# Altium project Kintex_SDR.PrjPcb (part 1 of 3)
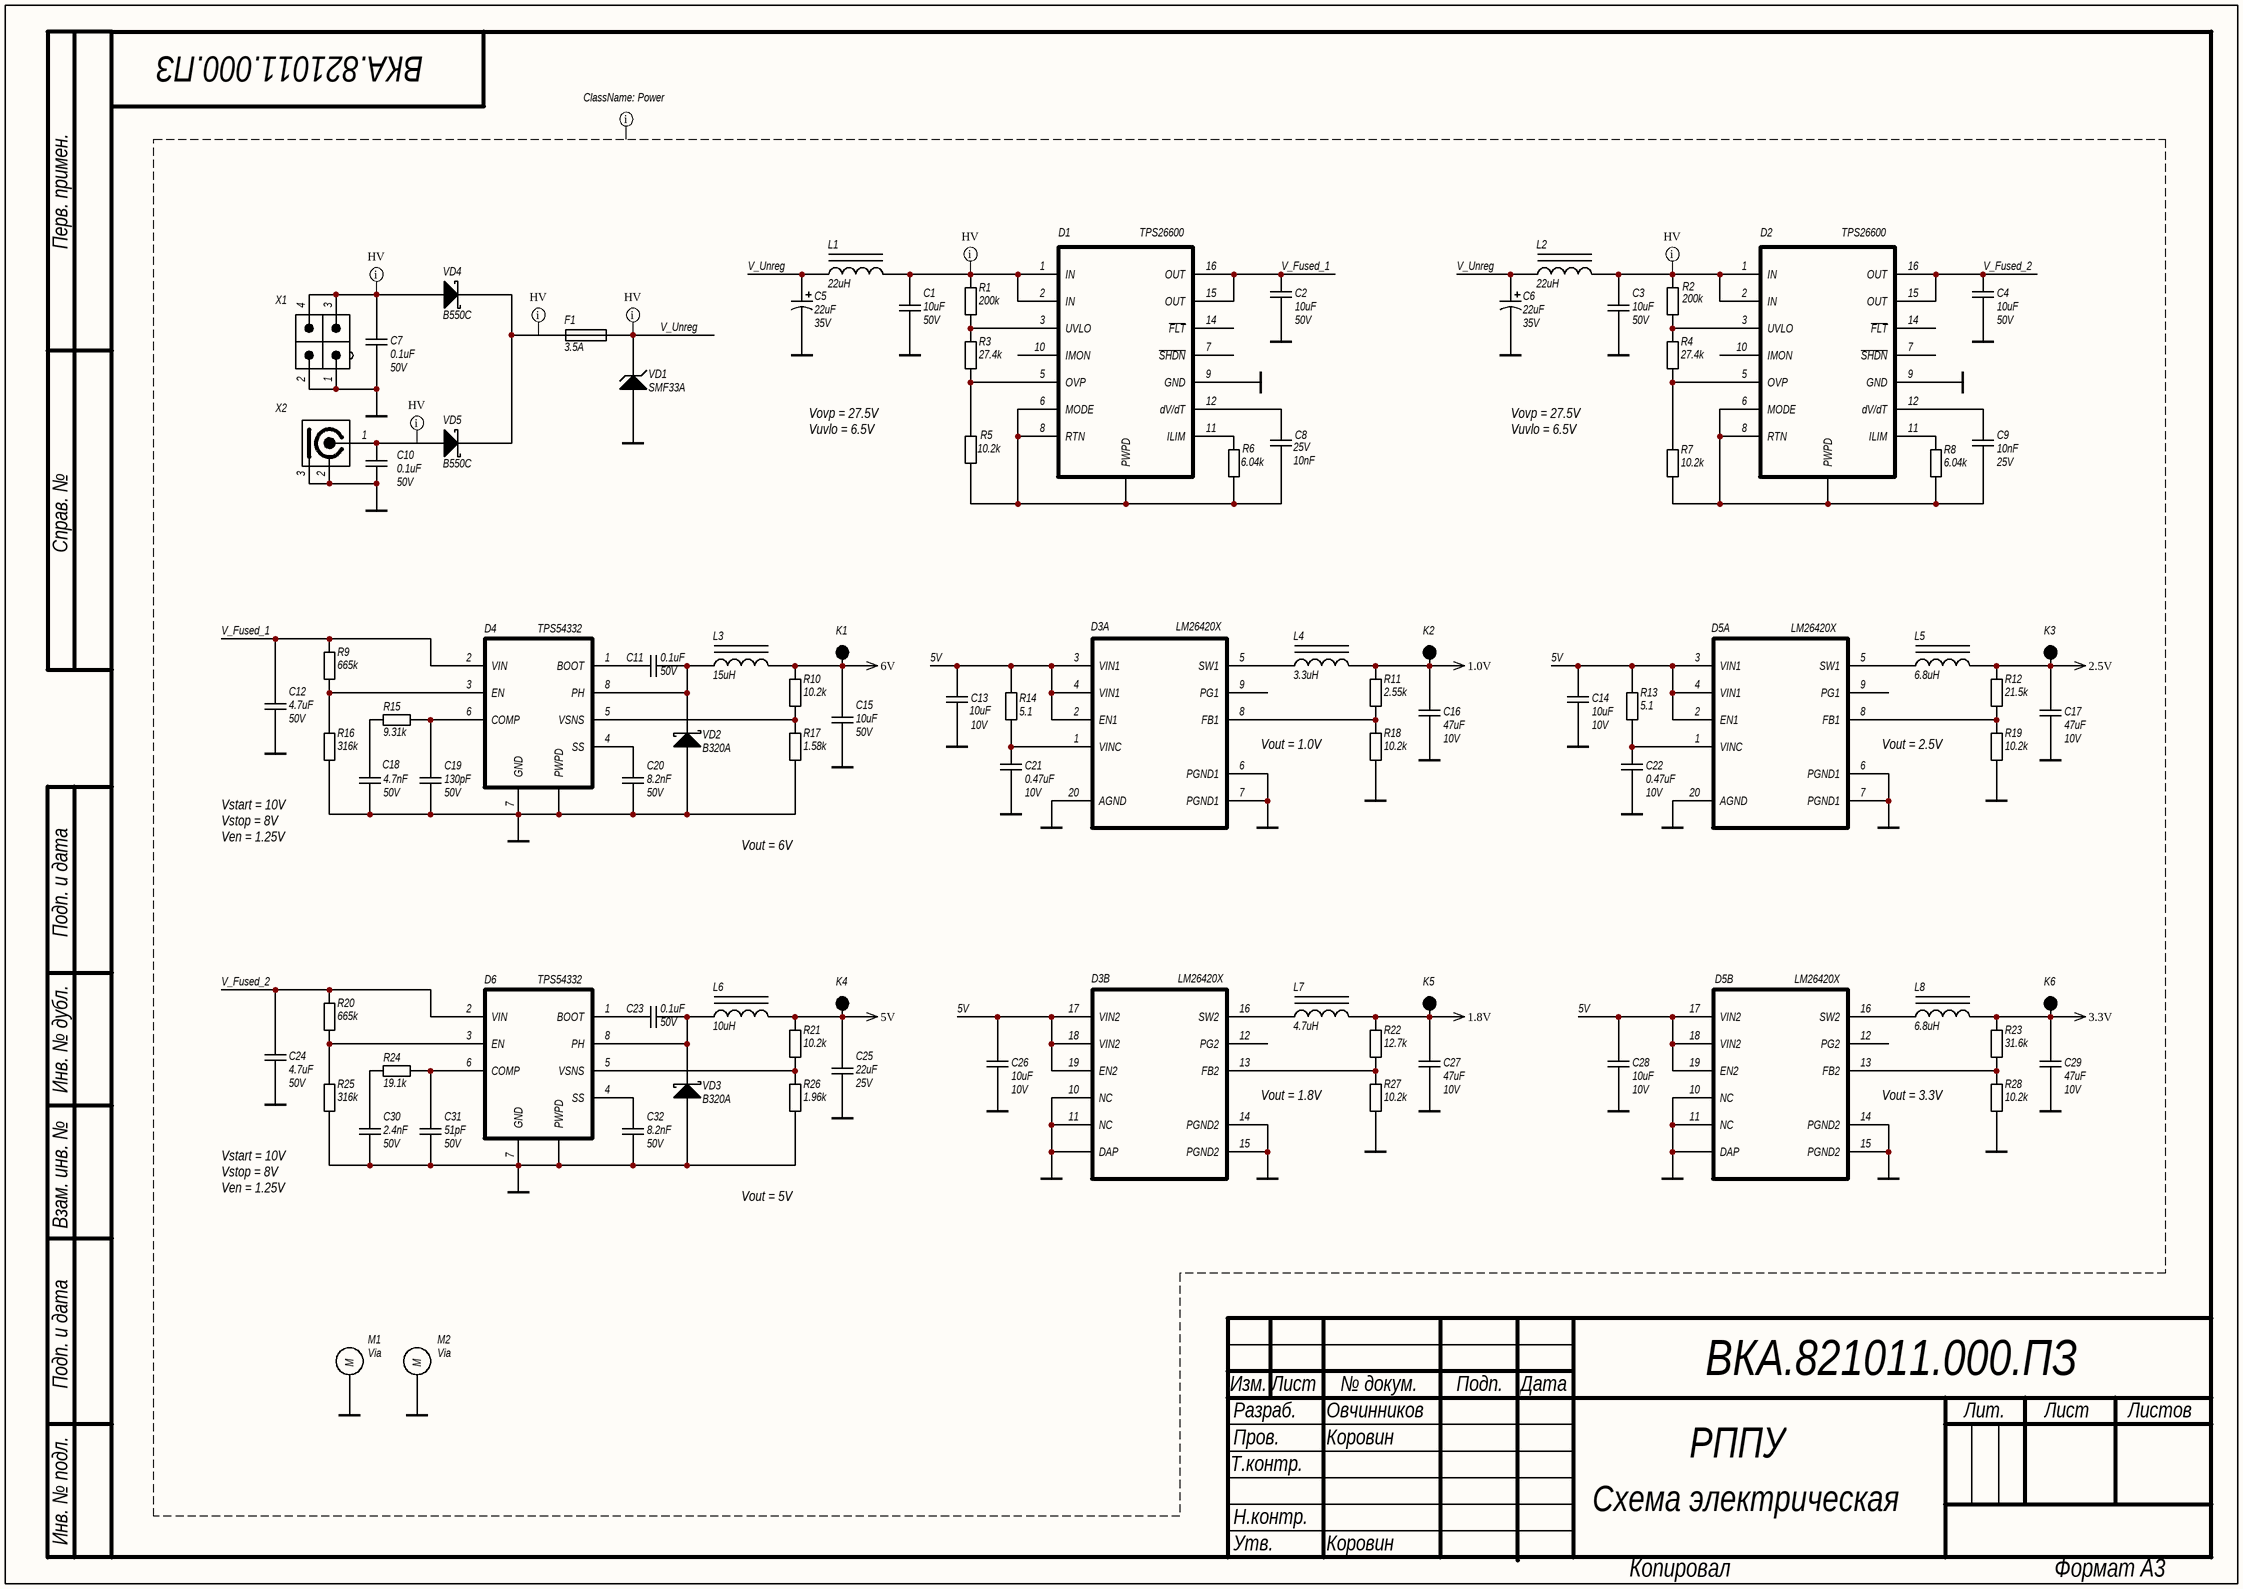
[diagram p0: PowerSupply.SchDoc]
6 sheets, 554 parts. Net scope: global (net labels, ports and power ports of the same name join across sheets).
Board file: MotherBoard.PcbDoc
Sheets:
  PowerSupply.SchDoc
  FPGAPower.SchDoc
  Configuration&Clocking&SRAM.SchDoc
  Codec's.SchDoc
  DaughterBoard.SchDoc
  Ethernet.SchDoc

## Sheet PowerSupply.SchDoc: РППУ
size 420 x 297 mm; ApprovedBy: Коровин; CheckedBy: Коровин; DrawnBy: Овчинников; DocumentNumber: ВКА.821011.000.ПЗ; Scale: {Мш.}; PageSetup: Record=PageOptions|CenterHorizontal=False|CenterVertical=False|PrintScale=0.70|XCorrection=0.00|YCorrection=0.00|PrintKind=1|BorderSize=5000000|LeftOffset=0|BottomOffset=0|Orientation=2|PaperLength=1000|PaperWidth=1000|Scale=100|PaperSource=15|PrintQuality=-3|MediaType=1|DitherType=10|PrintScaleMode=1|PaperKind=A4|PaperIndex=9; Mass: {М.}; DocumentType: Схема электрическая; Rule: PcbType=ProtelPcb

### Parts
C1  value 10uF  Voltage: 50V  [C1210]  (hidden comment: CAP uF)
C2  value 10uF  Voltage: 50V  [C1210]  (hidden comment: CAP uF)
C3  value 10uF  Voltage: 50V  [C1210]  (hidden comment: CAP uF)
C4  value 10uF  Voltage: 50V  [C1210]  (hidden comment: CAP uF)
C5  value 22uF  Voltage: 35V  [Tantalum_D]  (hidden comment: Cap Polarity)
C6  value 22uF  Voltage: 35V  [Tantalum_D]  (hidden comment: Cap Polarity)
C7  value 0.1uF  Voltage: 50V  [C0402]  (hidden comment: CAP)
C8  value 10nF  Voltage: 25V  [C0402]  (hidden comment: CAP)
C9  value 10nF  Voltage: 25V  [C0402]  (hidden comment: CAP)
C10  value 0.1uF  Voltage: 50V  [C0402]  (hidden comment: CAP)
C11  value 0.1uF  Voltage: 50V  [C0402]  (hidden comment: CAP)
C12  value 4.7uF  Voltage: 50V  [C0805]  (hidden comment: CAP uF)
C13  value 10uF  Voltage: 10V  [C0805]  (hidden comment: CAP uF)
C14  value 10uF  Voltage: 10V  [C0805]  (hidden comment: CAP uF)
C15  value 10uF  Voltage: 50V  [C1210]  (hidden comment: CAP uF)
C16  value 47uF  Voltage: 10V  [C1210]  (hidden comment: CAP uF)
C17  value 47uF  Voltage: 10V  [C1210]  (hidden comment: CAP uF)
C18  value 4.7nF  Voltage: 50V  [C0603]  (hidden comment: CAP)
C19  value 130pF  Voltage: 50V  [C0402]  (hidden comment: CAP)
C20  value 8.2nF  Voltage: 50V  [C0402]  (hidden comment: CAP)
C21  value 0.47uF  Voltage: 10V  [C0603]  (hidden comment: CAP)
C22  value 0.47uF  Voltage: 10V  [C0603]  (hidden comment: CAP)
C23  value 0.1uF  Voltage: 50V  [C0402]  (hidden comment: CAP)
C24  value 4.7uF  Voltage: 50V  [C0805]  (hidden comment: CAP uF)
C25  value 22uF  Voltage: 25V  [C1210]  (hidden comment: CAP uF)
C26  value 10uF  Voltage: 10V  [C0805]  (hidden comment: CAP uF)
C27  value 47uF  Voltage: 10V  [C1210]  (hidden comment: CAP uF)
C28  value 10uF  Voltage: 10V  [C0805]  (hidden comment: CAP uF)
C29  value 47uF  Voltage: 10V  [C1210]  (hidden comment: CAP uF)
C30  value 2.4nF  Voltage: 50V  [C0603]  (hidden comment: CAP)
C31  value 51pF  Voltage: 50V  [C0402]  (hidden comment: CAP)
C32  value 8.2nF  Voltage: 50V  [C0402]  (hidden comment: CAP)
D1  TPS26600  [R-PDSO-G16]
D2  TPS26600  [R-PDSO-G16]
D3  LM26420X  [HTSSOP-20]  (parts A,B of 2)
D4  TPS54332  [R-PDSO-G8]
D5  LM26420X  [HTSSOP-20]  (parts A,B of 2)
D6  TPS54332  [R-PDSO-G8]
F1  Current: 3.5A  [Fuse]  (hidden comment: FUSE)
K1  6V  [Control Point]  (value not drawn)
K2  1.0V  [Control Point]  (value not drawn)
K3  2.5V  [Control Point]  (value not drawn)
K4  5V  [Control Point]  (value not drawn)
K5  1.8V  [Control Point]  (value not drawn)
K6  3.3V  [Control Point]  (value not drawn)
L1  value 22uH  [XAL6060-223]  (hidden comment: Inductor PWR)
L2  value 22uH  [XAL6060-223]  (hidden comment: Inductor PWR)
L3  value 15uH  [XAL5050]  (hidden comment: Inductor PWR)
L4  value 3.3uH  [XAL4030]  (hidden comment: Inductor PWR)
L5  value 6.8uH  [XAL4030]  (hidden comment: Inductor PWR)
L6  value 10uH  [XAL5050]  (hidden comment: Inductor PWR)
L7  value 4.7uH  [XAL4030]  (hidden comment: Inductor PWR)
L8  value 6.8uH  [XAL4030]  (hidden comment: Inductor PWR)
M1  Via  [Mechanical_Via]
M2  Via  [Mechanical_Via]
R1  value 200k  [R0402]  (hidden comment: RES)
R2  value 200k  [R0402]  (hidden comment: RES)
R3  value 27.4k  [R0402]  (hidden comment: RES)
R4  value 27.4k  [R0402]  (hidden comment: RES)
R5  value 10.2k  [R0402]  (hidden comment: RES)
R6  value 6.04k  [R0402]  (hidden comment: RES)
R7  value 10.2k  [R0402]  (hidden comment: RES)
R8  value 6.04k  [R0402]  (hidden comment: RES)
R9  value 665k  [R0402]  (hidden comment: RES)
R10  value 10.2k  [R0402]  (hidden comment: RES)
R11  value 2.55k  [R0402]  (hidden comment: RES)
R12  value 21.5k  [R0402]  (hidden comment: RES)
R13  value 5.1  [R0402]  (hidden comment: RES)
R14  value 5.1  [R0402]  (hidden comment: RES)
R15  value 9.31k  [R0402]  (hidden comment: RES)
R16  value 316k  [R0402]  (hidden comment: RES)
R17  value 1.58k  [R0402]  (hidden comment: RES)
R18  value 10.2k  [R0402]  (hidden comment: RES)
R19  value 10.2k  [R0402]  (hidden comment: RES)
R20  value 665k  [R0402]  (hidden comment: RES)
R21  value 10.2k  [R0402]  (hidden comment: RES)
R22  value 12.7k  [R0402]  (hidden comment: RES)
R23  value 31.6k  [R0402]  (hidden comment: RES)
R24  value 19.1k  [R0402]  (hidden comment: RES)
R25  value 316k  [R0402]  (hidden comment: RES)
R26  value 1.96k  [R0402]  (hidden comment: RES)
R27  value 10.2k  [R0402]  (hidden comment: RES)
R28  value 10.2k  [R0402]  (hidden comment: RES)
VD1  SMF33A  [SOD-123F]
VD2  B320A  [Diode_SMA]
VD3  B320A  [Diode_SMA]
VD4  B550C  [Diode_SMC]
VD5  B550C  [Diode_SMC]
X1  miniFit  [2x2 PWR_HDR]  (value not drawn)
X2  POWER  [DC_CONNECTOR]  (value not drawn)

### Nets
1.0V: C16.2 K2.1 L4.2 R11.2
1.8V: C27.2 K5.1 L7.2 R22.2
2.5V: C17.2 K3.1 L5.2 R12.2
3.3V: C29.2 K6.1 L8.2 R23.2
5V: C13.2 C14.2 C25.2 C26.2 C28.2 D3.2(EN1) D3.3(VIN1) D3.4(VIN1) D3.17(VIN2) D3.18(VIN2) D3.19(EN2) D5.2(EN1) D5.3(VIN1) D5.4(VIN1) D5.17(VIN2) D5.18(VIN2) D5.19(EN2) K4.1 L6.2 R13.2 R14.1 R21.2
6V: C15.2 K1.1 L3.2 R10.2
GND: C1.1 C2.1 C3.1 C4.1 C5.2 C6.2 C7.1 C10.1 C12.1 C13.1 C14.1 C15.1 C16.1 C17.1 C18.2 C19.1 C20.1 C21.2 C22.1 C24.1 C25.1 C26.1 C27.1 C28.1 C29.1 C30.1 C31.1 C32.1 D1.9(GND) D2.9(GND) D3.6(PGND1) D3.7(PGND1) D3.10(NC) D3.11(NC) D3.14(PGND2) D3.15(PGND2) D3.20(AGND) D3.21(DAP) D4.7(GND) D4.9(PWPD) D5.6(PGND1) D5.7(PGND1) D5.10(NC) D5.11(NC) D5.14(PGND2) D5.15(PGND2) D5.20(AGND) D5.21(DAP) D6.7(GND) D6.9(PWPD) M1.0(M) M2.0(M) R16.1 R17.1 R18.1 R19.1 R25.1 R26.1 R27.1 R28.1 VD1.2(A) VD2.2(A) VD3.2(A) X1.1 X1.2 X2.2(GND) X2.3(GND)  [project net AGND_TX]
V_Fused_1: C2.2 C12.2 D1.15(OUT) D1.16(OUT) D4.2(VIN) R9.2
V_Fused_2: C4.2 C24.2 D2.15(OUT) D2.16(OUT) D6.2(VIN) R20.2
V_Unreg: C5.1 C6.1 F1.2 L1.1 L2.1 VD1.1(K)
NetC1_2: C1.2 D1.1(IN) D1.2(IN) L1.2 R1.2
NetC3_2: C3.2 D2.1(IN) D2.2(IN) L2.2 R2.1
NetC7_2: C7.2 VD4.2(A) X1.3 X1.4
NetC8_1: C8.1 D1.6(MODE) D1.8(RTN) D1.17(PWPD) R5.2 R6.1
NetC8_2: C8.2 D1.12(dV/dT)
NetC9_1: C9.1 D2.6(MODE) D2.8(RTN) D2.17(PWPD) R7.1 R8.1
NetC9_2: C9.2 D2.12(dV/dT)
NetC10_2: C10.2 VD5.2(A) X2.1(RF)
NetC11_1: C11.1 D4.8(PH) L3.1 VD2.1(K)
NetC11_2: C11.2 D4.1(BOOT)
NetC18_1: C18.1 R15.1
NetC19_2: C19.2 D4.6(COMP) R15.2
NetC20_2: C20.2 D4.4(SS)
NetC21_1: C21.1 D3.1(VINC) R14.2
NetC22_2: C22.2 D5.1(VINC) R13.1
NetC23_1: C23.1 D6.8(PH) L6.1 VD3.1(K)
NetC23_2: C23.2 D6.1(BOOT)
NetC30_2: C30.2 R24.2
NetC31_2: C31.2 D6.6(COMP) R24.1
NetC32_2: C32.2 D6.4(SS)
NetD1_3: D1.3(UVLO) R1.1 R3.2
NetD1_5: D1.5(OVP) R3.1 R5.1
NetD1_11: D1.11(ILIM) R6.2
NetD2_3: D2.3(UVLO) R2.2 R4.2
NetD2_5: D2.5(OVP) R4.1 R7.2
NetD2_11: D2.11(ILIM) R8.2
NetD3_5: D3.5(SW1) L4.1
NetD3_8: D3.8(FB1) R11.1 R18.2
NetD3_13: D3.13(FB2) R22.1 R27.2
NetD3_16: D3.16(SW2) L7.1
NetD4_3: D4.3(EN) R9.1 R16.2
NetD4_5: D4.5(VSNS) R10.1 R17.2
NetD5_5: D5.5(SW1) L5.1
NetD5_8: D5.8(FB1) R12.1 R19.2
NetD5_13: D5.13(FB2) R23.1 R28.2
NetD5_16: D5.16(SW2) L8.1
NetD6_3: D6.3(EN) R20.1 R25.2
NetD6_5: D6.5(VSNS) R21.1 R26.2
NetF1_1: F1.1 VD4.1(K) VD5.1(K)

Not connected (* = marked no-connect by the designer): D1 7(~{SHDN}) 10(IMON) 14(~{FLT}); D2 7(~{SHDN}) 10(IMON) 14(~{FLT}); D3 9(PG1) 12(PG2); D5 9(PG1) 12(PG2)

### Layout directives
net class Power: 1.0V, 1.8V, 2.5V, 3.3V, 5V, 6V, GND, V_Fused_1, V_Fused_2, V_Unreg
net class HV: NetC1_2, NetC3_2, NetC7_2, NetC10_2, NetF1_1, V_Unreg

### Notes on the sheet
- Vovp = 27.5V
  Vuvlo = 6.5V
- Vout = 1.0V
- Vout = 2.5V
- Vstart = 10V
  Vstop = 8V
  Ven = 1.25V
- Vout = 6V
- Vout = 1.8V
- Vout = 3.3V
- Vout = 5V
- Перв. примен.
- Справ. №
- Подп. и дата
- Инв. № дубл.
- Взам. инв. №
- Изм.
- Лист
- № докум.
- Подп.
- Дата
- Т.контр.
- Пров.
- Разраб.
- Лит.
- Листов
- Инв. № подл.
- Н.контр.
- Утв.
- Копировал
- Формат А3

### Library data of the parts
C1-C4 C15 = CAP uF: SMD Capacitor; Manufacturer: Murata; Material: X7R; Tolerance: 10%; Type: Ceramic Capacitor; P/N: GRM32ER71H106KA12L
C5 C6 = Cap Polarity: Tantalum Polarity SMD Capacitor; Manufacturer: AVX Corporation; Name: Tantalum Capacitor; Tolerance: 10%; Type: Tantalum Polarity Cap; P/N: TPSD226K035R0200; Temperature Range: -55…85°C
C7 C10 C11 C23 = CAP: SMD Capacitor; Manufacturer: Murata; Material: X7R; Tolerance: 10%; Type: Ceramic Capacitor; P/N: GRM155R71H104KE14J
C8 C9 = CAP: SMD Capacitor; Manufacturer: Murata; Material: X7R; Tolerance: 5%; Type: Ceramic Capacitor; P/N: GRM155R71E103KA01D
C12 C24 = CAP uF: SMD Capacitor; Manufacturer: Murata; Material: X5R; Tolerance: 20%; Type: Ceramic Capacitor; P/N: GRM21BR61H475KE51L
C13 C14 C26 C28 = CAP uF: SMD Capacitor; Manufacturer: Murata; Material: X5R; Tolerance: 10%; Type: Ceramic Capacitor; P/N: GRM21BR71A106KE51L
C16 C17 C27 C29 = CAP uF: SMD Capacitor; Manufacturer: Murata; Material: X7R; Tolerance: 10%; Type: Ceramic Capacitor; P/N: GRM32ER71A476KE15L
C18 = CAP: SMD Capacitor; Manufacturer: Murata; Material: NP0; Tolerance: 5%; Type: Ceramic Capacitor; P/N: GRM1885C1H472JA01D
C19 = CAP: SMD Capacitor; Manufacturer: Murata; Material: NP0; Tolerance: 5%; Type: Ceramic Capacitor; P/N: GRM1555C1H131JA01D
C20 C32 = CAP: SMD Capacitor; Manufacturer: Murata; Material: X7R; Tolerance: 10%; Type: Ceramic Capacitor; P/N: GRM155R71H822KA88D
C21 C22 = CAP: SMD Capacitor; Manufacturer: Murata; Material: X7R; Tolerance: 10%; Type: Ceramic Capacitor; P/N: GRM188R71A474KA61D
C25 = CAP uF: SMD Capacitor; Manufacturer: Murata; Material: X7R; Tolerance: 10%; Type: Ceramic Capacitor; P/N: GRM32ER71E226KE15L
C30 = CAP: SMD Capacitor; Manufacturer: Murata; Material: NP0; Tolerance: 5%; Type: Ceramic Capacitor; P/N: GRM1885C1H242JA01D
C31 = CAP: SMD Capacitor; Manufacturer: Murata; Material: NP0; Tolerance: 5%; Type: Ceramic Capacitor; P/N: GRM1555C1H510JA01D
D1 D2 = TPS26600: Industrial eFuse; Current: 2A; Voltage: 60V; Name: TPS26600; Package: 16-Pin SOIC PowerPAD; Temperature Range: −40°C to + 125°C; Type: Industrial eFuse
D3 D5 = LM26420X: Synchronous  DC-DC Converter; Current: 2A; Frequency: 2.2MHz; Input Voltage: 3 V to 5.5 V; Name: LM26420X; Package: HTSSOP 20; Temperature Range: −40°C to + 150°C; Type: Synchronous DC-DC Converter
D4 D6 = TPS54332: Step-Down DC-DC Converter; Current: 3.5A; Frequency: 1MHz; Input Voltage: 3.5V to 28V; Name: TPS54332; Package: 8-Pin SOIC PowerPAD; Temperature Range: −40°C to + 150°C; Type: Step-Down DC-DC Converter
F1 = FUSE: Chip SMD Fuse; Name: Fast Fuse; Type: Fast Chip SMD Fuse; Voltage: 125V; Package: SMD Omni Block
K1-K6 = Test  Point
L1 L2 = Inductor PWR: Magnetic-Core Inductor; Manufacturer: Coilcraft; Name: XAL6060-223MEB; Current: 5A; Tolerance: ±30%; Temperature Range: -40ºC to 125ºC
L3 = Inductor PWR: Magnetic-Core Inductor; Manufacturer: Coilcraft; Name: XAL5050-153MEB; Current: 5A; Tolerance: ±30%; Temperature Range: -40ºC to 125ºC
L4 = Inductor PWR: Magnetic-Core Inductor; Manufacturer: Coilcraft; Name: XEL4030-332MEB; Current: 5A; Tolerance: ±30%; Temperature Range: -40ºC to 125ºC
L5 L8 = Inductor PWR: Magnetic-Core Inductor; Manufacturer: Coilcraft; Name: XEL4030-682MEB; Current: 5A; Tolerance: ±30%; Temperature Range: -40ºC to 125ºC
L6 = Inductor PWR: Magnetic-Core Inductor; Manufacturer: Coilcraft; Name: XAL5050-103MEB; Current: 5A; Tolerance: ±30%; Temperature Range: -40ºC to 125ºC
L7 = Inductor PWR: Magnetic-Core Inductor; Manufacturer: Coilcraft; Name: XEL4030-472MEB; Current: 5A; Tolerance: ±30%; Temperature Range: -40ºC to 125ºC
M1 M2 = Mechanical Via
R1 R2 = RES: SMD Resistor; Manufacturer: Panasonic Electronic Components; Name: Chip SMD Resistor; Power: 0.062 Wt; Tolerance: 1%; P/N: ERJ-2RKF2003X; Temperature Range: -55…155°C
R3 R4 = RES: SMD Resistor; Manufacturer: Panasonic Electronic Components; Name: Chip SMD Resistor; Power: 0.062 Wt; Tolerance: 1%; P/N: ERJ-2RKF2742X; Temperature Range: -55…155°C
R5 R7 R10 R18 R19 R21 R27 R28 = RES: SMD Resistor; Manufacturer: Panasonic Electronic Components; Name: Chip SMD Resistor; Power: 0.062 Wt; Tolerance: 1%; P/N: ERJ-2RKF1022X; Temperature Range: -55…155°C
R6 R8 = RES: SMD Resistor; Manufacturer: Panasonic Electronic Components; Name: Chip SMD Resistor; Power: 0.062 Wt; Tolerance: 1%; P/N: ERJ-2RKF6041X; Temperature Range: -55…155°C
R9 R20 = RES: SMD Resistor; Manufacturer: Panasonic Electronic Components; Name: Chip SMD Resistor; Power: 0.062 Wt; Tolerance: 1%; P/N: ERJ-2RKF6653X; Temperature Range: -55…155°C
R11 = RES: SMD Resistor; Manufacturer: Panasonic Electronic Components; Name: Chip SMD Resistor; Power: 0.062 Wt; Tolerance: 1%; P/N: ERJ-2RKF2551X; Temperature Range: -55…155°C
R12 = RES: SMD Resistor; Manufacturer: Panasonic Electronic Components; Name: Chip SMD Resistor; Power: 0.062 Wt; Tolerance: 1%; P/N: ERJ-2RKF2152X; Temperature Range: -55…155°C
R13 R14 = RES: SMD Resistor; Manufacturer: Panasonic Electronic Components; Name: Chip SMD Resistor; Power: 0.062 Wt; Tolerance: 5%; P/N: ERJ-2GEJ5R1X; Temperature Range: -55…155°C
R15 = RES: SMD Resistor; Manufacturer: Panasonic Electronic Components; Name: Chip SMD Resistor; Power: 0.062 Wt; Tolerance: 1%; P/N: ERJ-2RKF9311X; Temperature Range: -55…155°C
R16 R25 = RES: SMD Resistor; Manufacturer: Panasonic Electronic Components; Name: Chip SMD Resistor; Power: 0.062 Wt; Tolerance: 1%; P/N: ERJ-2RKF3163X; Temperature Range: -55…155°C
R17 = RES: SMD Resistor; Manufacturer: Panasonic Electronic Components; Name: Chip SMD Resistor; Power: 0.062 Wt; Tolerance: 1%; P/N: ERJ-2RKF1581X; Temperature Range: -55…155°C
R22 = RES: SMD Resistor; Manufacturer: Panasonic Electronic Components; Name: Chip SMD Resistor; Power: 0.062 Wt; Tolerance: 1%; P/N: ERJ-2RKF1272X; Temperature Range: -55…155°C
R23 = RES: SMD Resistor; Manufacturer: Panasonic Electronic Components; Name: Chip SMD Resistor; Power: 0.062 Wt; Tolerance: 1%; P/N: ERJ-2RKF3162X; Temperature Range: -55…155°C
R24 = RES: SMD Resistor; Manufacturer: Panasonic Electronic Components; Name: Chip SMD Resistor; Power: 0.062 Wt; Tolerance: 1%; P/N: ERJ-2RKF1912X; Temperature Range: -55…155°C
R26 = RES: SMD Resistor; Manufacturer: Panasonic Electronic Components; Name: Chip SMD Resistor; Power: 0.062 Wt; Tolerance: 1%; P/N: ERJ-2RKF1961X; Temperature Range: -55…155°C
VD1 = TVS: TVS Diode; Manufacturer: Littelfuse; Power: 200W; Voltage: 33V; Name: SMF33A; Package: SOD-123F
VD2-VD5 = Shottky: Schottky Diode; Package: SMC
  VD2 VD3: Name: B320A
  VD4 VD5: Name: B550C
X1 = HDR 2x2 miniFit: 2x2 miniFit DC Power Connector; Current: 5A; Name: Mini-Fit Power Connector; Voltage: 12V; Type: 2x2
X2 = Connector DC: DC Power Connector 6mm; Current: 5A; Voltage: 12V; Name: DC Power Connector; Package: Trough Hole; Type: 2.5mm*5.7mm

## Sheet FPGAPower.SchDoc: {Наименование}
size 420 x 297 mm; DocumentNumber: ВКА.821011.000.ПЗ; PageSetup: Record=PageOptions|CenterHorizontal=False|CenterVertical=False|PrintScale=0.95|XCorrection=0.00|YCorrection=0.00|PrintKind=1|BorderSize=5000000|LeftOffset=0|BottomOffset=0|Orientation=1|PaperLength=1000|PaperWidth=1000|Scale=100|PaperSource=15|PrintQuality=600|MediaType=1|DitherType=10|PaperKind=A4|PrintScaleMode=1; Rule: PcbType=ProtelPcb
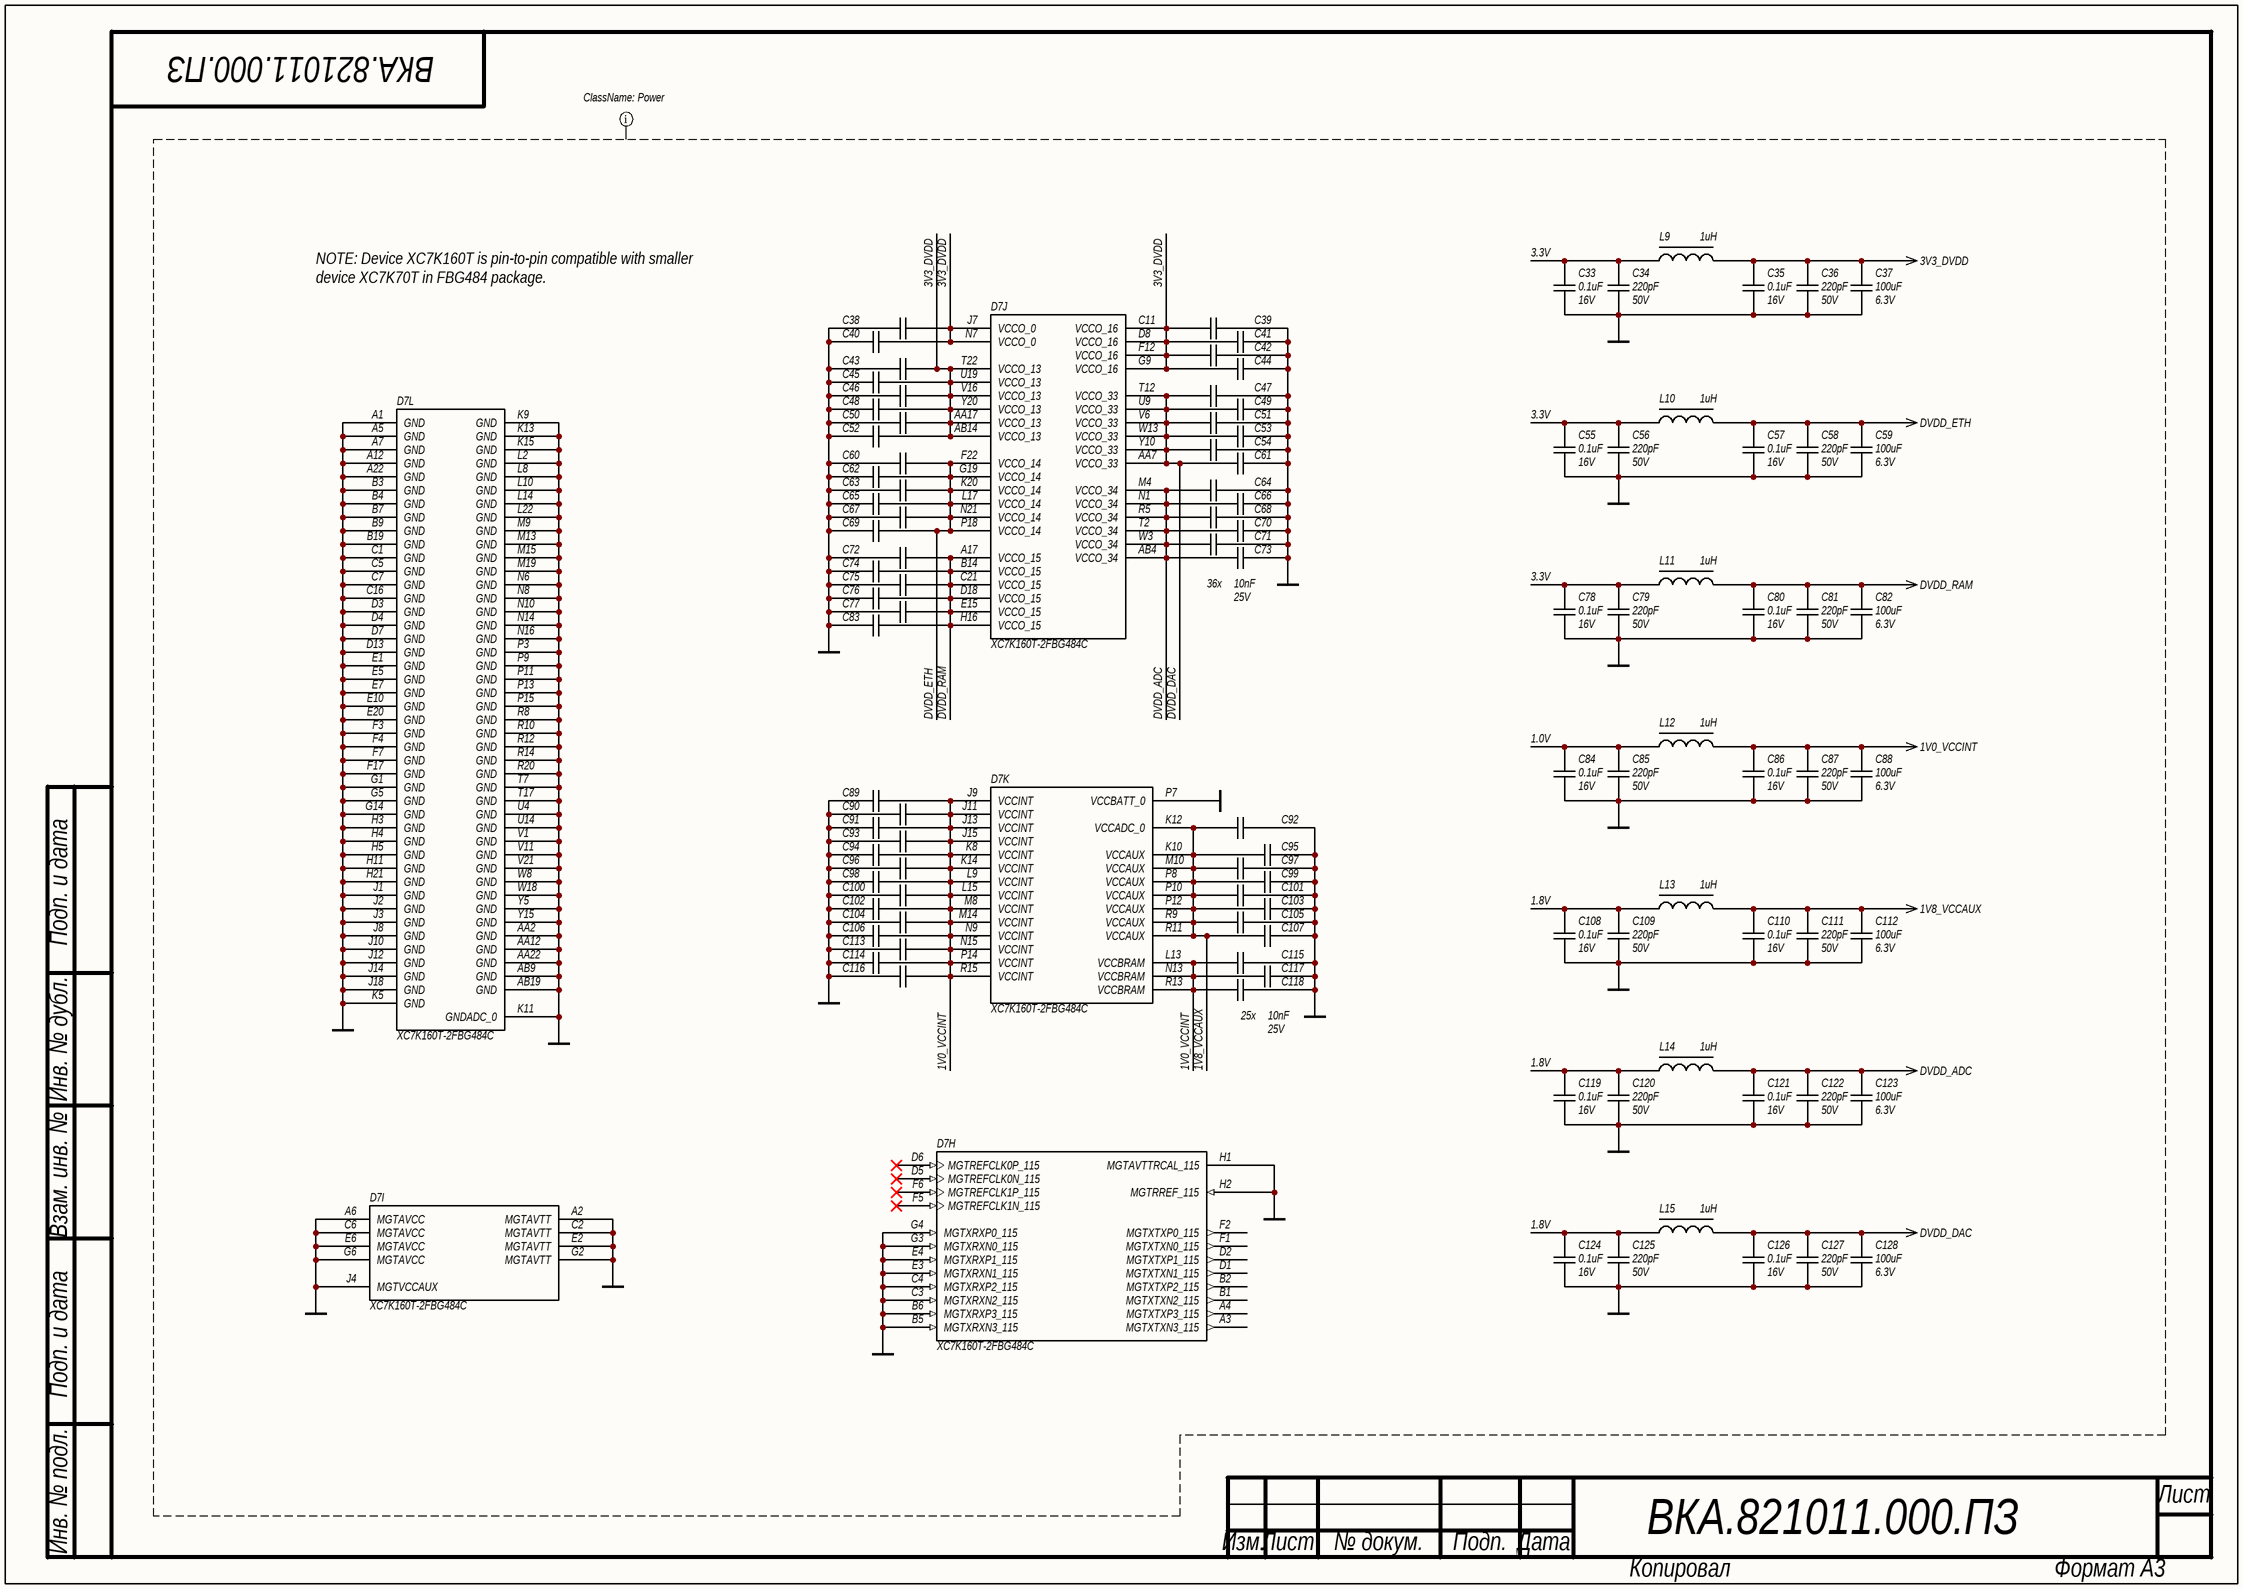
[diagram p1: FPGAPower.SchDoc]

### Parts
C33  value 0.1uF  Voltage: 16V  [C0603]  (hidden comment: CAP)
C34  value 220pF  Voltage: 50V  [C0603]  (hidden comment: CAP)
C35  value 0.1uF  Voltage: 16V  [C0603]  (hidden comment: CAP)
C36  value 220pF  Voltage: 50V  [C0603]  (hidden comment: CAP)
C37  value 100uF  Voltage: 6.3V  [C1210]  (hidden comment: CAP uF)
C38  CAP  [C0402]  (value not drawn)
C39  CAP  [C0402]  (value not drawn)
C40  CAP  [C0402]  (value not drawn)
C41  CAP  [C0402]  (value not drawn)
C42  CAP  [C0402]  (value not drawn)
C43  CAP  [C0402]  (value not drawn)
C44  CAP  [C0402]  (value not drawn)
C45  CAP  [C0402]  (value not drawn)
C46  CAP  [C0402]  (value not drawn)
C47  CAP  [C0402]  (value not drawn)
C48  CAP  [C0402]  (value not drawn)
C49  CAP  [C0402]  (value not drawn)
C50  CAP  [C0402]  (value not drawn)
C51  CAP  [C0402]  (value not drawn)
C52  CAP  [C0402]  (value not drawn)
C53  CAP  [C0402]  (value not drawn)
C54  CAP  [C0402]  (value not drawn)
C55  value 0.1uF  Voltage: 16V  [C0603]  (hidden comment: CAP)
C56  value 220pF  Voltage: 50V  [C0603]  (hidden comment: CAP)
C57  value 0.1uF  Voltage: 16V  [C0603]  (hidden comment: CAP)
C58  value 220pF  Voltage: 50V  [C0603]  (hidden comment: CAP)
C59  value 100uF  Voltage: 6.3V  [C1210]  (hidden comment: CAP uF)
C60  CAP  [C0402]  (value not drawn)
C61  CAP  [C0402]  (value not drawn)
C62  CAP  [C0402]  (value not drawn)
C63  CAP  [C0402]  (value not drawn)
C64  CAP  [C0402]  (value not drawn)
C65  CAP  [C0402]  (value not drawn)
C66  CAP  [C0402]  (value not drawn)
C67  CAP  [C0402]  (value not drawn)
C68  CAP  [C0402]  (value not drawn)
C69  CAP  [C0402]  (value not drawn)
C70  CAP  [C0402]  (value not drawn)
C71  CAP  [C0402]  (value not drawn)
C72  CAP  [C0402]  (value not drawn)
C73  value 10nF  Voltage: 25V  [C0402]  (hidden comment: CAP)
C74  CAP  [C0402]  (value not drawn)
C75  CAP  [C0402]  (value not drawn)
C76  CAP  [C0402]  (value not drawn)
C77  CAP  [C0402]  (value not drawn)
C78  value 0.1uF  Voltage: 16V  [C0603]  (hidden comment: CAP)
C79  value 220pF  Voltage: 50V  [C0603]  (hidden comment: CAP)
C80  value 0.1uF  Voltage: 16V  [C0603]  (hidden comment: CAP)
C81  value 220pF  Voltage: 50V  [C0603]  (hidden comment: CAP)
C82  value 100uF  Voltage: 6.3V  [C1210]  (hidden comment: CAP uF)
C83  CAP  [C0402]  (value not drawn)
C84  value 0.1uF  Voltage: 16V  [C0603]  (hidden comment: CAP)
C85  value 220pF  Voltage: 50V  [C0603]  (hidden comment: CAP)
C86  value 0.1uF  Voltage: 16V  [C0603]  (hidden comment: CAP)
C87  value 220pF  Voltage: 50V  [C0603]  (hidden comment: CAP)
C88  value 100uF  Voltage: 6.3V  [C1210]  (hidden comment: CAP uF)
C89  CAP  [C0402]  (value not drawn)
C90  CAP  [C0402]  (value not drawn)
C91  CAP  [C0402]  (value not drawn)
C92  CAP  [C0402]  (value not drawn)
C93  CAP  [C0402]  (value not drawn)
C94  CAP  [C0402]  (value not drawn)
C95  CAP  [C0402]  (value not drawn)
C96  CAP  [C0402]  (value not drawn)
C97  CAP  [C0402]  (value not drawn)
C98  CAP  [C0402]  (value not drawn)
C99  CAP  [C0402]  (value not drawn)
C100  CAP  [C0402]  (value not drawn)
C101  CAP  [C0402]  (value not drawn)
C102  CAP  [C0402]  (value not drawn)
C103  CAP  [C0402]  (value not drawn)
C104  CAP  [C0402]  (value not drawn)
C105  CAP  [C0402]  (value not drawn)
C106  CAP  [C0402]  (value not drawn)
C107  CAP  [C0402]  (value not drawn)
C108  value 0.1uF  Voltage: 16V  [C0603]  (hidden comment: CAP)
C109  value 220pF  Voltage: 50V  [C0603]  (hidden comment: CAP)
C110  value 0.1uF  Voltage: 16V  [C0603]  (hidden comment: CAP)
C111  value 220pF  Voltage: 50V  [C0603]  (hidden comment: CAP)
C112  value 100uF  Voltage: 6.3V  [C1210]  (hidden comment: CAP uF)
C113  CAP  [C0402]  (value not drawn)
C114  CAP  [C0402]  (value not drawn)
C115  CAP  [C0402]  (value not drawn)
C116  CAP  [C0402]  (value not drawn)
C117  CAP  [C0402]  (value not drawn)
C118  value 10nF  Voltage: 25V  [C0402]  (hidden comment: CAP)
C119  value 0.1uF  Voltage: 16V  [C0603]  (hidden comment: CAP)
C120  value 220pF  Voltage: 50V  [C0603]  (hidden comment: CAP)
C121  value 0.1uF  Voltage: 16V  [C0603]  (hidden comment: CAP)
C122  value 220pF  Voltage: 50V  [C0603]  (hidden comment: CAP)
C123  value 100uF  Voltage: 6.3V  [C1210]  (hidden comment: CAP uF)
C124  value 0.1uF  Voltage: 16V  [C0603]  (hidden comment: CAP)
C125  value 220pF  Voltage: 50V  [C0603]  (hidden comment: CAP)
C126  value 0.1uF  Voltage: 16V  [C0603]  (hidden comment: CAP)
C127  value 220pF  Voltage: 50V  [C0603]  (hidden comment: CAP)
C128  value 100uF  Voltage: 6.3V  [C1210]  (hidden comment: CAP uF)
D7  XC7K160T-2FBG484C  [FBG484]  (parts H,I,J,K,L of 12)
L9  value 1uH  [L1210_Murata LQH]  (hidden comment: Inductor LF)
L10  value 1uH  [L1210_Murata LQH]  (hidden comment: Inductor LF)
L11  value 1uH  [L1210_Murata LQH]  (hidden comment: Inductor LF)
L12  value 1uH  [L1210_Murata LQH]  (hidden comment: Inductor LF)
L13  value 1uH  [L1210_Murata LQH]  (hidden comment: Inductor LF)
L14  value 1uH  [L1210_Murata LQH]  (hidden comment: Inductor LF)
L15  value 1uH  [L1210_Murata LQH]  (hidden comment: Inductor LF)

### Nets
1.0V: C84.2 C85.2 L12.1
1.8V: C108.2 C109.2 C119.2 C120.2 C124.2 C125.2 L13.1 L14.1 L15.1
1V0_VCCINT: C86.2 C87.2 C88.2 C89.1 C90.1 C91.1 C93.1 C94.1 C96.1 C98.1 C100.1 C102.1 C104.1 C106.1 C113.1 C114.1 C115.2 C116.1 C117.2 C118.2 D7.J9(VCCINT) D7.J11(VCCINT) D7.J13(VCCINT) D7.J15(VCCINT) D7.K8(VCCINT) D7.K14(VCCINT) D7.L9(VCCINT) D7.L13(VCCBRAM) D7.L15(VCCINT) D7.M8(VCCINT) D7.M14(VCCINT) D7.N9(VCCINT) D7.N13(VCCBRAM) D7.N15(VCCINT) D7.P14(VCCINT) D7.R13(VCCBRAM) D7.R15(VCCINT) L12.2
1V8_VCCAUX: C92.2 C95.2 C97.2 C99.2 C101.2 C103.2 C105.2 C107.2 C110.2 C111.2 C112.2 D7.K10(VCCAUX) D7.K12(VCCADC_0) D7.M10(VCCAUX) D7.P8(VCCAUX) D7.P10(VCCAUX) D7.P12(VCCAUX) D7.R9(VCCAUX) D7.R11(VCCAUX) L13.2
3.3V: C33.2 C34.2 C55.2 C56.2 C78.2 C79.2 L9.1 L10.1 L11.1
3V3_DVDD: C35.2 C36.2 C37.2 C38.1 C39.2 C40.1 C41.2 C42.2 C43.1 C44.2 C45.1 C46.1 C48.1 C50.1 C52.1 D7.AA17(VCCO_13) D7.AB14(VCCO_13) D7.C11(VCCO_16) D7.D8(VCCO_16) D7.F12(VCCO_16) D7.G9(VCCO_16) D7.J7(VCCO_0) D7.N7(VCCO_0) D7.T22(VCCO_13) D7.U19(VCCO_13) D7.V16(VCCO_13) D7.Y20(VCCO_13) L9.2
DVDD_ADC: C64.2 C66.2 C68.2 C70.2 C71.2 C73.2 C121.2 C122.2 C123.2 D7.AB4(VCCO_34) D7.M4(VCCO_34) D7.N1(VCCO_34) D7.R5(VCCO_34) D7.T2(VCCO_34) D7.W3(VCCO_34) L14.2
DVDD_DAC: C47.2 C49.2 C51.2 C53.2 C54.2 C61.2 C126.2 C127.2 C128.2 D7.AA7(VCCO_33) D7.T12(VCCO_33) D7.U9(VCCO_33) D7.V6(VCCO_33) D7.W13(VCCO_33) D7.Y10(VCCO_33) L15.2
DVDD_ETH: C57.2 C58.2 C59.2 C60.1 C62.1 C63.1 C65.1 C67.1 C69.1 D7.F22(VCCO_14) D7.G19(VCCO_14) D7.K20(VCCO_14) D7.L17(VCCO_14) D7.N21(VCCO_14) D7.P18(VCCO_14) L10.2
DVDD_RAM: C72.1 C74.1 C75.1 C76.1 C77.1 C80.2 C81.2 C82.2 C83.1 D7.A17(VCCO_15) D7.B14(VCCO_15) D7.C21(VCCO_15) D7.D18(VCCO_15) D7.E15(VCCO_15) D7.H16(VCCO_15) L11.2
GND: C33.1 C34.1 C35.1 C36.1 C37.1 C38.2 C39.1 C40.2 C41.1 C42.1 C43.2 C44.1 C45.2 C46.2 C47.1 C48.2 C49.1 C50.2 C51.1 C52.2 C53.1 C54.1 C55.1 C56.1 C57.1 C58.1 C59.1 C60.2 C61.1 C62.2 C63.2 C64.1 C65.2 C66.1 C67.2 C68.1 C69.2 C70.1 C71.1 C72.2 C73.1 C74.2 C75.2 C76.2 C77.2 C78.1 C79.1 C80.1 C81.1 C82.1 C83.2 C84.1 C85.1 C86.1 C87.1 C88.1 C89.2 C90.2 C91.2 C92.1 C93.2 C94.2 C95.1 C96.2 C97.1 C98.2 C99.1 C100.2 C101.1 C102.2 C103.1 C104.2 C105.1 C106.2 C107.1 C108.1 C109.1 C110.1 C111.1 C112.1 C113.2 C114.2 C115.1 C116.2 C117.1 C118.1 C119.1 C120.1 C121.1 C122.1 C123.1 C124.1 C125.1 C126.1 C127.1 C128.1 D7.A1(GND) D7.A2(MGTAVTT) D7.A5(GND) D7.A6(MGTAVCC) D7.A7(GND) D7.A12(GND) D7.A22(GND) D7.AA2(GND) D7.AA12(GND) D7.AA22(GND) D7.AB9(GND) D7.AB19(GND) D7.B3(GND) D7.B4(GND) D7.B5(MGTXRXN3_115) D7.B6(MGTXRXP3_115) D7.B7(GND) D7.B9(GND) D7.B19(GND) D7.C1(GND) D7.C2(MGTAVTT) D7.C3(MGTXRXN2_115) D7.C4(MGTXRXP2_115) D7.C5(GND) D7.C6(MGTAVCC) D7.C7(GND) D7.C16(GND) D7.D3(GND) D7.D4(GND) D7.D7(GND) D7.D13(GND) D7.E1(GND) D7.E2(MGTAVTT) D7.E3(MGTXRXN1_115) D7.E4(MGTXRXP1_115) D7.E5(GND) D7.E6(MGTAVCC) D7.E7(GND) D7.E10(GND) D7.E20(GND) D7.F3(GND) D7.F4(GND) D7.F7(GND) D7.F17(GND) D7.G1(GND) D7.G2(MGTAVTT) D7.G3(MGTXRXN0_115) D7.G4(MGTXRXP0_115) D7.G5(GND) D7.G6(MGTAVCC) D7.G14(GND) D7.H1(MGTAVTTRCAL_115) D7.H2(MGTRREF_115) D7.H3(GND) D7.H4(GND) D7.H5(GND) D7.H11(GND) D7.H21(GND) D7.J1(GND) D7.J2(GND) D7.J3(GND) D7.J4(MGTVCCAUX) D7.J8(GND) D7.J10(GND) D7.J12(GND) D7.J14(GND) D7.J18(GND) D7.K5(GND) D7.K9(GND) D7.K11(GNDADC_0) D7.K13(GND) D7.K15(GND) D7.L2(GND) D7.L8(GND) D7.L10(GND) D7.L14(GND) D7.L22(GND) D7.M9(GND) D7.M13(GND) D7.M15(GND) D7.M19(GND) D7.N6(GND) D7.N8(GND) D7.N10(GND) D7.N14(GND) D7.N16(GND) D7.P3(GND) D7.P7(VCCBATT_0) D7.P9(GND) D7.P11(GND) D7.P13(GND) D7.P15(GND) D7.R8(GND) D7.R10(GND) D7.R12(GND) D7.R14(GND) D7.R20(GND) D7.T7(GND) D7.T17(GND) D7.U4(GND) D7.U14(GND) D7.V1(GND) D7.V11(GND) D7.V21(GND) D7.W8(GND) D7.W18(GND) D7.Y5(GND) D7.Y15(GND)  [project net AGND_TX]

Not connected (* = marked no-connect by the designer): D7 A3(MGTXTXN3_115) A4(MGTXTXP3_115) B1(MGTXTXN2_115) B2(MGTXTXP2_115) D1(MGTXTXN1_115) D2(MGTXTXP1_115) D5(MGTREFCLK0N_115)* D6(MGTREFCLK0P_115)* F1(MGTXTXN0_115) F2(MGTXTXP0_115) F5(MGTREFCLK1N_115)* F6(MGTREFCLK1P_115)*

### Layout directives
net class Power: 1.0V, 1.8V, 1V0_VCCINT, 1V8_VCCAUX, 3.3V, 3V3_DVDD, DVDD_ADC, DVDD_DAC, DVDD_ETH, DVDD_RAM, GND

### Notes on the sheet
- NOTE: Device XC7K160T is pin-to-pin compatible with smaller device XC7K70T in FBG484 package.
- 36x
- 25x
- Подп. и дата
- Инв. № дубл.
- Взам. инв. №
- Инв. № подл.
- Лист
- Изм.
- № докум.
- Подп.
- Дата
- Копировал
- Формат А3

### Library data of the parts
C33 C35 C55 C57 C78 C80 C84 C86 C108 C110 C119 C121 C124 C126 = CAP: SMD Capacitor; Manufacturer: Murata; Material: X7R; Tolerance: 10%; Type: Ceramic Capacitor; P/N: GRM188R71C104KA01D
C34 C36 C56 C58 C79 C81 C85 C87 C109 C111 C120 C122 C125 C127 = CAP: SMD Capacitor; Manufacturer: Murata; Material: X7R; Tolerance: 10%; Type: Ceramic Capacitor; P/N: GRM188R71H221KA01D
C37 C59 C82 C88 C112 C123 C128 = CAP uF: SMD Capacitor; Manufacturer: Murata; Material: X5R; Tolerance: 20%; Type: Ceramic Capacitor; P/N: GRM32ER60J107ME20L
C38-C54 C60-C72 C74-C77 C83 C89-C107 C113-C117 = CAP: SMD Capacitor; Manufacturer: Murata; Material: X7R; Tolerance: 10%; Voltage: 25V; Type: Ceramic Capacitor; Value: 10nF; P/N: GRM155R71E103KA01D
C73 C118 = CAP: SMD Capacitor; Manufacturer: Murata; Material: X7R; Tolerance: 10%; Type: Ceramic Capacitor; P/N: GRM155R71E103KA01D
D7 = XC7K160T-2FBG484C: Xilinx 7-Series FPGA; Speed Grade: -2; Manufacturer: Xilinx; Name: XC7K160T-2FBG484C; Series: 7-Series FPGA; Package: 484 Ball FBG
L9-L15 = Inductor LF: Inductor Power Lines; Manufacturer: Murata; Name: LQH32PN1R0NNC; Current: 2500mA; Tolerance: 5%; Frequency: 100MHz; Temperature Range: -25ºC to 85ºC; Series: LQH; P/N: LQH32PN1R0NNC

## Sheet Configuration&Clocking&SRAM.SchDoc: {Наименование}
size 420 x 297 mm; DocumentNumber: ВКА.821011.000.ПЗ; PageSetup: Record=PageOptions|CenterHorizontal=False|CenterVertical=False|PrintScale=0.70|XCorrection=0.00|YCorrection=0.00|PrintKind=1|BorderSize=5000000|LeftOffset=0|BottomOffset=0|Orientation=1|PaperLength=2970|PaperWidth=4200|Scale=100|PaperSource=7|PrintQuality=600|MediaType=1|DitherType=10|PrintScaleMode=1|PaperKind=A3 (повернуто)|PaperIndex=76; Rule: PcbType=ProtelPcb
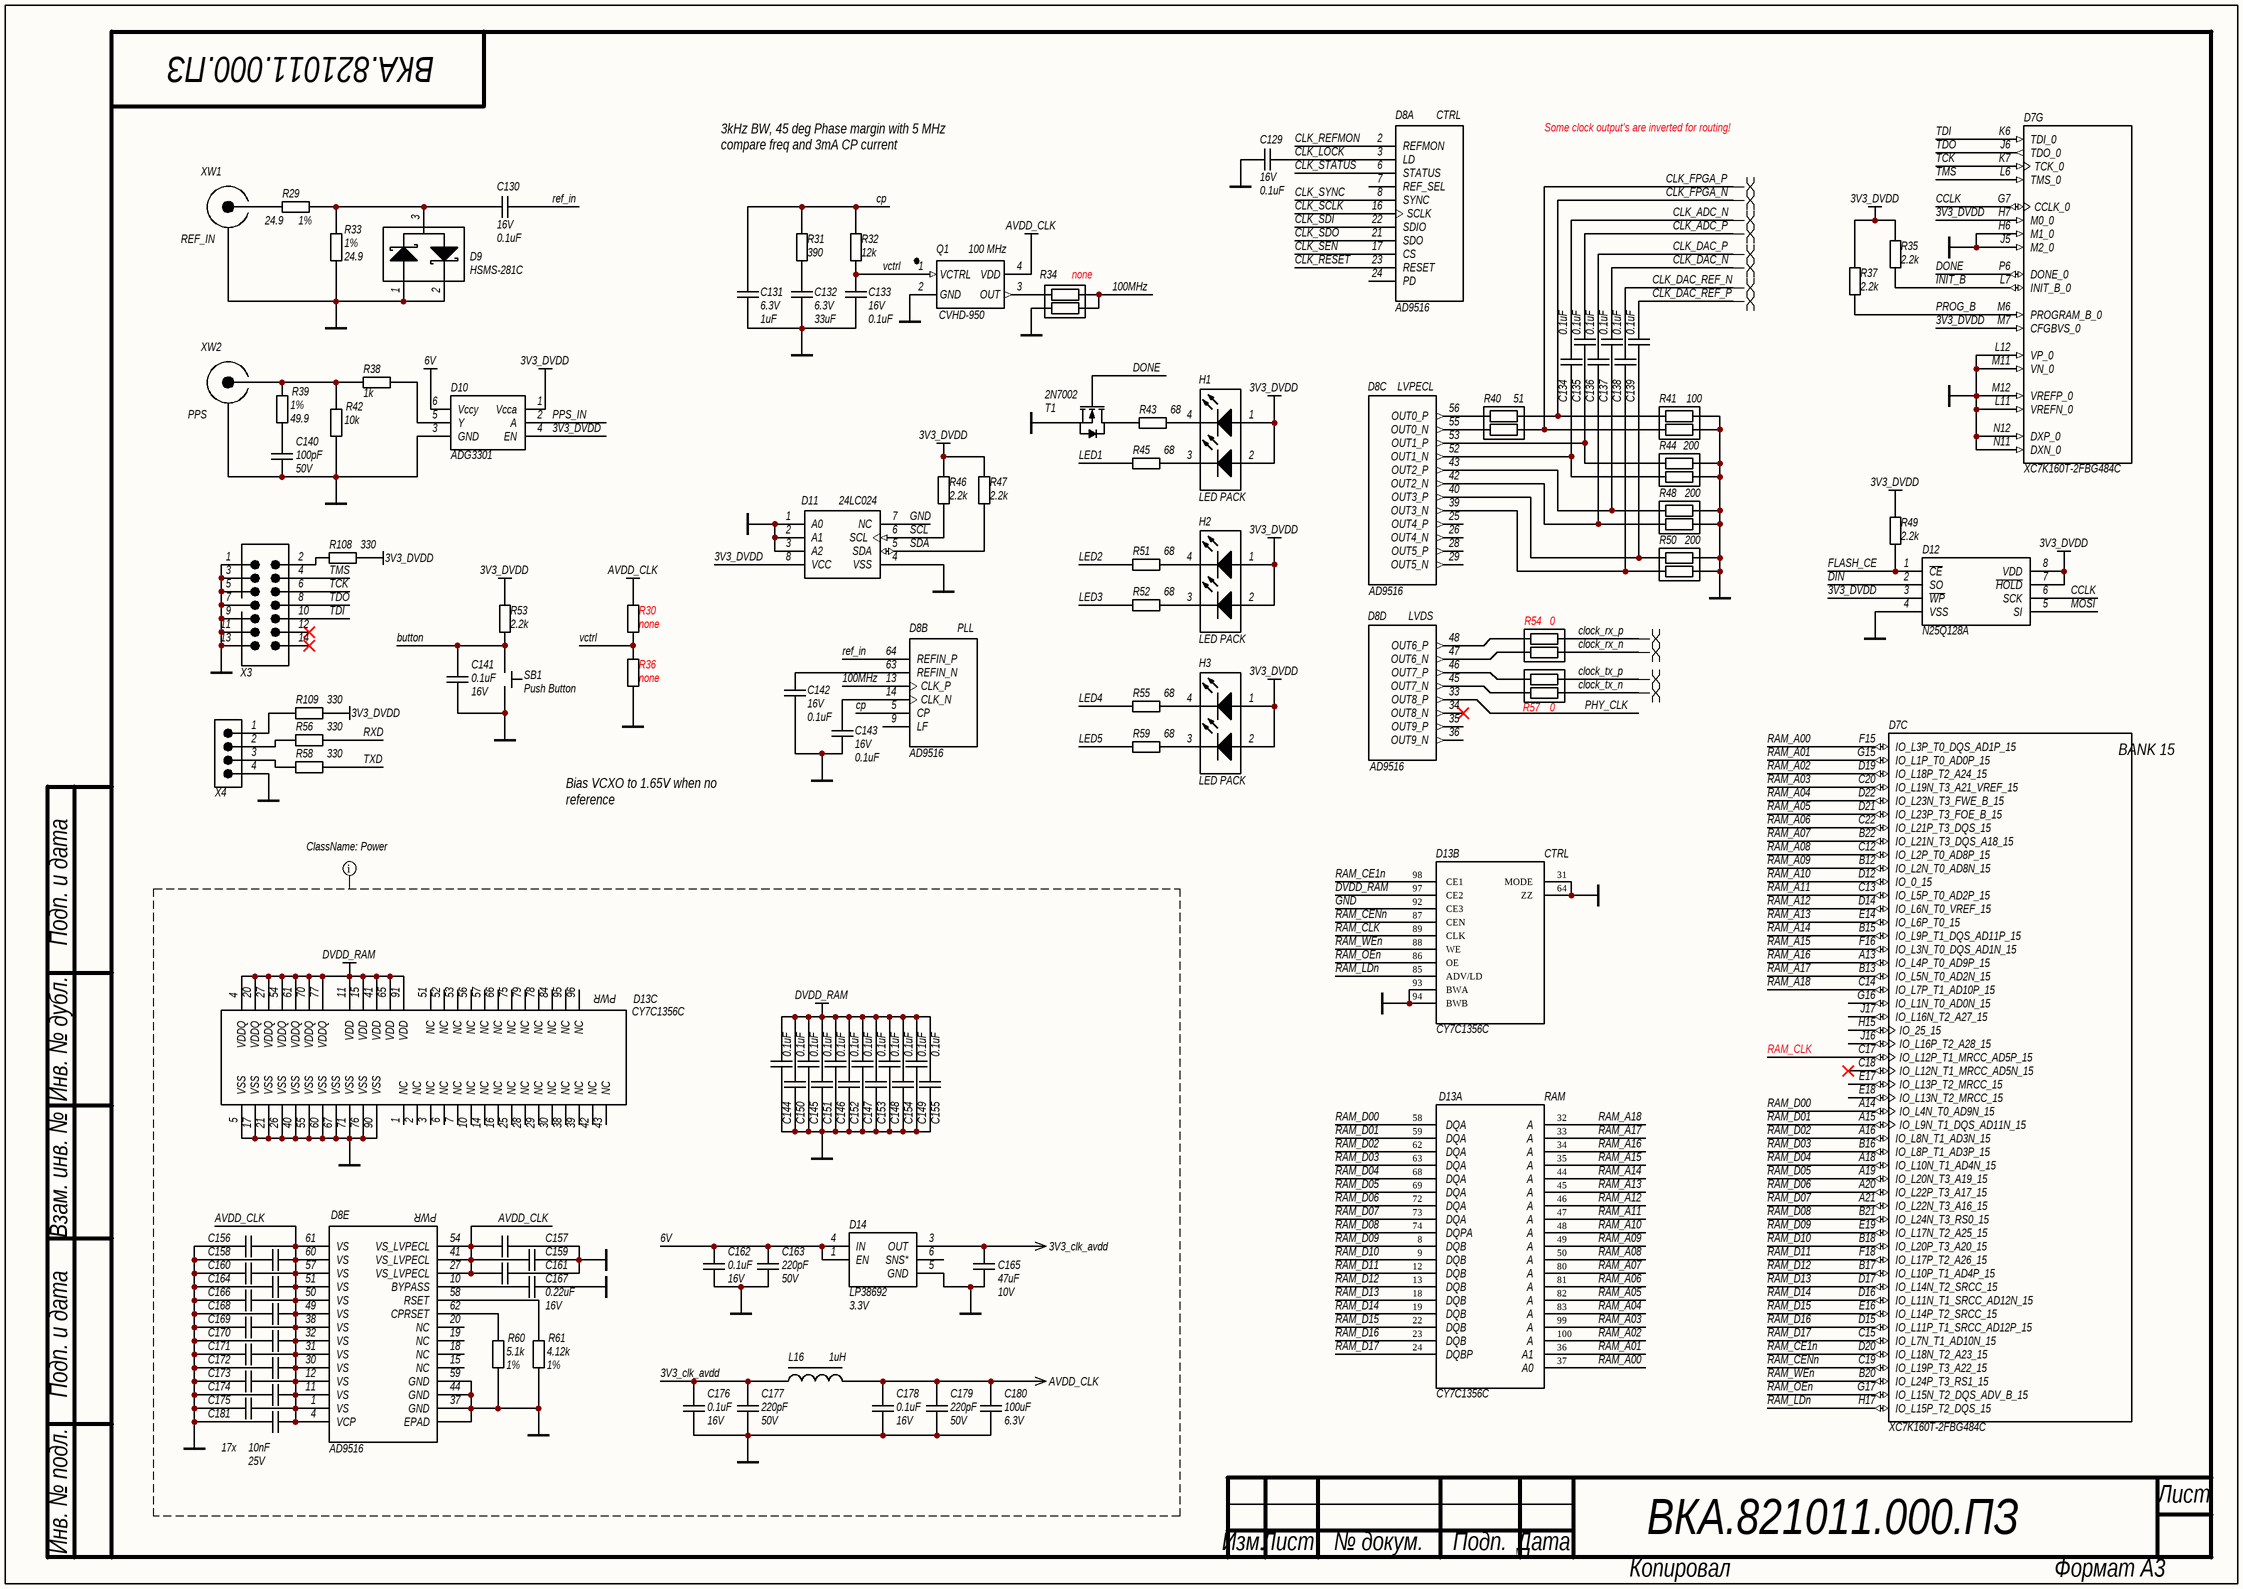
[diagram p2: Configuration&Clocking&SRAM.SchDoc]

### Parts
C129  value 0.1uF  Voltage: 16V  [C0402]  (hidden comment: CAP)
C130  value 0.1uF  Voltage: 16V  [C0402]  (hidden comment: CAP)
C131  value 1uF  Voltage: 6.3V  [C0402]  (hidden comment: CAP)
C132  value 33uF  Voltage: 6.3V  [C1210]  (hidden comment: CAP uF)
C133  value 0.1uF  Voltage: 16V  [C0402]  (hidden comment: CAP)
C134  value 0.1uF  [C0402]  (hidden comment: CAP)
C135  value 0.1uF  [C0402]  (hidden comment: CAP)
C136  value 0.1uF  [C0402]  (hidden comment: CAP)
C137  value 0.1uF  [C0402]  (hidden comment: CAP)
C138  value 0.1uF  [C0402]  (hidden comment: CAP)
C139  value 0.1uF  [C0402]  (hidden comment: CAP)
C140  value 100pF  Voltage: 50V  [C0603]  (hidden comment: CAP)
C141  value 0.1uF  Voltage: 16V  [C0402]  (hidden comment: CAP)
C142  value 0.1uF  Voltage: 16V  [C0402]  (hidden comment: CAP)
C143  value 0.1uF  Voltage: 16V  [C0402]  (hidden comment: CAP)
C144  value 0.1uF  [C0402]  (hidden comment: CAP)
C145  value 0.1uF  [C0402]  (hidden comment: CAP)
C146  value 0.1uF  [C0402]  (hidden comment: CAP)
C147  value 0.1uF  [C0402]  (hidden comment: CAP)
C148  value 0.1uF  [C0402]  (hidden comment: CAP)
C149  value 0.1uF  [C0402]  (hidden comment: CAP)
C150  value 0.1uF  [C0402]  (hidden comment: CAP)
C151  value 0.1uF  [C0402]  (hidden comment: CAP)
C152  value 0.1uF  [C0402]  (hidden comment: CAP)
C153  value 0.1uF  [C0402]  (hidden comment: CAP)
C154  value 0.1uF  [C0402]  (hidden comment: CAP)
C155  value 0.1uF  [C0402]  (hidden comment: CAP)
C156  CAP  [C0402]  (value not drawn)
C157  CAP  [C0402]  (value not drawn)
C158  CAP  [C0402]  (value not drawn)
C159  CAP  [C0402]  (value not drawn)
C160  CAP  [C0402]  (value not drawn)
C161  CAP  [C0402]  (value not drawn)
C162  value 0.1uF  Voltage: 16V  [C0603]  (hidden comment: CAP)
C163  value 220pF  Voltage: 50V  [C0603]  (hidden comment: CAP)
C164  CAP  [C0402]  (value not drawn)
C165  value 47uF  Voltage: 10V  [C1210]  (hidden comment: CAP uF)
C166  CAP  [C0402]  (value not drawn)
C167  value 0.22uF  Voltage: 16V  [C0402]  (hidden comment: CAP)
C168  CAP  [C0402]  (value not drawn)
C169  CAP  [C0402]  (value not drawn)
C170  CAP  [C0402]  (value not drawn)
C171  CAP  [C0402]  (value not drawn)
C172  CAP  [C0402]  (value not drawn)
C173  CAP  [C0402]  (value not drawn)
C174  CAP  [C0402]  (value not drawn)
C175  CAP  [C0402]  (value not drawn)
C176  value 0.1uF  Voltage: 16V  [C0603]  (hidden comment: CAP)
C177  value 220pF  Voltage: 50V  [C0603]  (hidden comment: CAP)
C178  value 0.1uF  Voltage: 16V  [C0603]  (hidden comment: CAP)
C179  value 220pF  Voltage: 50V  [C0603]  (hidden comment: CAP)
C180  value 100uF  Voltage: 6.3V  [C1210]  (hidden comment: CAP uF)
C181  value 10nF  Voltage: 25V  [C0402]  (hidden comment: CAP)
D7  XC7K160T-2FBG484C  [FBG484]  (parts C,G of 12)
D8  AD9516  [LFCSP-64]  (parts A,B,C,D,E of 5)
D9  HSMS-281C  [SOT-323]
D10  ADG3301  [SOT-23-6]
D11  24LC024  [SOIC_SN8]
D12  N25Q128A  [SOIC8-W]
D13  CY7C1356C  [TQFP-100]  (parts A,B,C of 3)
D14  LP38692  Voltage: 3.3V  [SOT-223-5]
H1  LED PACK  [LED_PACK]
H2  LED PACK  [LED_PACK]
H3  LED PACK  [LED_PACK]
L16  value 1uH  [L1210_Murata]  (hidden comment: Inductor LF)
Q1  CVHD-950  Frequency: 100 MHz  [CVHD-950]
R29  value 24.9  Tolerance: 1%  [R0402]  (hidden comment: RES)
R30  value none  [R0402]  (hidden comment: RES)
R31  value 390  [R0402]  (hidden comment: RES)
R32  value 12k  [R0402]  (hidden comment: RES)
R33  value 24.9  Tolerance: 1%  [R0402]  (hidden comment: RES)
R34  value none  [EX24V]  (hidden comment: RES 2x0402)
R35  value 2.2k  [R0402]  (hidden comment: RES)
R36  value none  [R0402]  (hidden comment: RES)
R37  value 2.2k  [R0402]  (hidden comment: RES)
R38  value 1k  [R0402]  (hidden comment: RES)
R39  value 49.9  Tolerance: 1%  [R0402]  (hidden comment: RES)
R40  value 51  [EX24V]  (hidden comment: RES 2x0402)
R41  value 100  [EX24V]  (hidden comment: RES 2x0402)
R42  value 10k  [R0402]  (hidden comment: RES)
R43  value 68  [R0402]  (hidden comment: RES)
R44  value 200  [EX24V]  (hidden comment: RES 2x0402)
R45  value 68  [R0402]  (hidden comment: RES)
R46  value 2.2k  [R0402]  (hidden comment: RES)
R47  value 2.2k  [R0402]  (hidden comment: RES)
R48  value 200  [EX24V]  (hidden comment: RES 2x0402)
R49  value 2.2k  [R0402]  (hidden comment: RES)
R50  value 200  [EX24V]  (hidden comment: RES 2x0402)
R51  value 68  [R0402]  (hidden comment: RES)
R52  value 68  [R0402]  (hidden comment: RES)
R53  value 2.2k  [R0402]  (hidden comment: RES)
R54  value 0  [EX24V]  (hidden comment: RES 2x0402)
R55  value 68  [R0402]  (hidden comment: RES)
R56  value 330  [R0402]  (hidden comment: RES)
R57  value 0  [EX24V]  (hidden comment: RES 2x0402)
R58  value 330  [R0402]  (hidden comment: RES)
R59  value 68  [R0402]  (hidden comment: RES)
R60  value 5.1k  Tolerance: 1%  [R0402]  (hidden comment: RES)
R61  value 4.12k  Tolerance: 1%  [R0402]  (hidden comment: RES)
R108  value 330  [R0402]  (hidden comment: RES)
R109  value 330  [R0402]  (hidden comment: RES)
SB1  Push Button  [B3FS-1000]
T1  2N7002  [SOT-23]
X3  HDR Debug_14-pin  [JTAG Header 14-pin]  (value not drawn)
X4  HDR 4-way  [Right Angle Male Header]  (value not drawn)
XW1  REF_IN  [SMA Angle Female]
XW2  PPS  [SMA Angle Female]

### Nets
3V3_clk_avdd: C165.2 C176.2 C177.2 D14.3(OUT) L16.1
3V3_DVDD: D7.H7(M0_0) D7.M7(CFGBVS_0) D10.1(Vcca) D10.4(EN) D11.8(VCC) D12.3(~{WP}) D12.7(~{HOLD}) D12.8(VDD) H1.1(A) H1.2(A) H2.1(A) H2.2(A) H3.1(A) H3.2(A) R35.2 R37.2 R46.2 R47.2 R49.2 R53.2 R108.1 R109.1
6V: C162.2 C163.2 D10.6(Vccy) D14.1(EN) D14.4(IN)
AVDD_CLK: C156.1 C157.2 C158.1 C159.2 C160.1 C161.2 C164.1 C166.1 C168.1 C169.1 C170.1 C171.1 C172.1 C173.1 C174.1 C175.1 C178.2 C179.2 C180.2 C181.1 D8.1(VS) D8.4(VCP) D8.11(VS) D8.12(VS) D8.27(VS_LVPECL) D8.30(VS) D8.31(VS) D8.32(VS) D8.38(VS) D8.41(VS_LVPECL) D8.49(VS) D8.50(VS) D8.51(VS) D8.54(VS_LVPECL) D8.57(VS) D8.60(VS) D8.61(VS) L16.2 Q1.4(VDD) R30.2
DVDD_RAM: C144.2 C145.2 C146.2 C147.2 C148.2 C149.2 C150.2 C151.2 C152.2 C153.2 C154.2 C155.2 D13.4(VDDQ) D13.11(VDD) D13.15(VDD) D13.20(VDDQ) D13.27(VDDQ) D13.41(VDD) D13.54(VDDQ) D13.61(VDDQ) D13.65(VDD) D13.70(VDDQ) D13.77(VDDQ) D13.91(VDD) D13.97(CE2)
GND: C129.2 C131.2 C132.2 C133.2 C140.1 C141.1 C142.2 C143.2 C144.1 C145.1 C146.1 C147.1 C148.1 C149.1 C150.1 C151.1 C152.1 C153.1 C154.1 C155.1 C156.2 C157.1 C158.2 C159.1 C160.2 C161.1 C162.1 C163.1 C164.2 C165.1 C166.2 C167.1 C168.2 C169.2 C170.2 C171.2 C172.2 C173.2 C174.2 C175.2 C176.1 C177.1 C178.1 C179.1 C180.1 C181.2 D7.H6(M1_0) D7.J5(M2_0) D7.L11(VREFN_0) D7.L12(VP_0) D7.M11(VN_0) D7.M12(VREFP_0) D7.N11(DXN_0) D7.N12(DXP_0) D8.0(EPAD) D8.37(GND) D8.44(GND) D8.59(GND) D9.1(A) D9.2(K) D10.3(GND) D11.1(A0) D11.2(A1) D11.3(A2) D11.4(VSS) D11.7(NC) D12.4(VSS) D13.5(VSS) D13.17(VSS) D13.21(VSS) D13.26(VSS) D13.31(MODE) D13.40(VSS) D13.55(VSS) D13.60(VSS) D13.64(ZZ) D13.67(VSS) D13.71(VSS) D13.76(VSS) D13.90(VSS) D13.92(CE3) D13.93(BWA) D13.94(BWB) D14.5(GND) Q1.2(GND) R33.1 R34.2 R36.1 R41.3 R41.4 R42.1 R44.3 R44.4 R48.3 R48.4 R50.3 R50.4 R60.1 R61.1 SB1.2 T1.2(S) X3.1(GND) X3.3(GND) X3.5(GND) X3.7(GND) X3.9(GND) X3.11(GND) X3.13(GND) X4.4(TMS) XW1.0(GND) XW2.0(GND)  [project net AGND_TX]
100MHz: D8.13(CLK_P) R34.3 R34.4
button: C141.2 R53.1 SB1.1
CCLK: D7.G7(CCLK_0) D12.6(SCK)
CLK_ADC_N: C134.1
CLK_ADC_P: C135.1
CLK_DAC_N: C137.1
CLK_DAC_P: C136.1
CLK_DAC_REF_N: C138.1
CLK_DAC_REF_P: C139.1
CLK_FPGA_N: R40.4 R41.1
CLK_FPGA_P: R40.3 R41.2
CLK_LOCK: C129.1 D8.3(LD)
CLK_REFMON: D8.2(REFMON)
CLK_RESET: D8.23(RESET)
CLK_SCLK: D8.16(SCLK)
CLK_SDI: D8.22(SDIO)
CLK_SDO: D8.21(SDO)
CLK_SEN: D8.17(CS)
CLK_STATUS: D8.6(STATUS)
CLK_SYNC: D8.8(SYNC)
clock_rx_n: R54.3
clock_rx_p: R54.4
clock_tx_n: R57.3
clock_tx_p: R57.4
cp: C131.1 D8.5(CP) R31.1 R32.2
DIN: D12.2(SO)
DONE: D7.P6(DONE_0) T1.1(G)
FLASH_CE: D12.1(~{CE}) R49.1
INIT_B: D7.L7(INIT_B_0) R35.1
LED1: R45.2
LED2: R51.2
LED3: R52.2
LED4: R55.2
LED5: R59.2
MOSI: D12.5(SI)
PHY_CLK: D8.33(OUT8_P)
PPS_IN: D10.2(A)
PROG_B: D7.M6(PROGRAM_B_0) R37.1
RAM_A00: D7.F15(IO_L3P_T0_DQS_AD1P_15) D13.37(A0)
RAM_A01: D7.G15(IO_L1P_T0_AD0P_15) D13.36(A1)
RAM_A02: D7.D19(IO_L18P_T2_A24_15) D13.100(A)
RAM_A03: D7.C20(IO_L19N_T3_A21_VREF_15) D13.99(A)
RAM_A04: D7.D22(IO_L23N_T3_FWE_B_15) D13.83(A)
RAM_A05: D7.D21(IO_L23P_T3_FOE_B_15) D13.82(A)
RAM_A06: D7.C22(IO_L21P_T3_DQS_15) D13.81(A)
RAM_A07: D7.B22(IO_L21N_T3_DQS_A18_15) D13.80(A)
RAM_A08: D7.C12(IO_L2P_T0_AD8P_15) D13.50(A)
RAM_A09: D7.B12(IO_L2N_T0_AD8N_15) D13.49(A)
RAM_A10: D7.D12(IO_0_15) D13.48(A)
RAM_A11: D7.C13(IO_L5P_T0_AD2P_15) D13.47(A)
RAM_A12: D7.D14(IO_L6N_T0_VREF_15) D13.46(A)
RAM_A13: D7.E14(IO_L6P_T0_15) D13.45(A)
RAM_A14: D7.B15(IO_L9P_T1_DQS_AD11P_15) D13.44(A)
RAM_A15: D7.F16(IO_L3N_T0_DQS_AD1N_15) D13.35(A)
RAM_A16: D7.A13(IO_L4P_T0_AD9P_15) D13.34(A)
RAM_A17: D7.B13(IO_L5N_T0_AD2N_15) D13.33(A)
RAM_A18: D7.C14(IO_L7P_T1_AD10P_15) D13.32(A)
RAM_CE1n: D7.D20(IO_L18N_T2_A23_15) D13.98(CE1)
RAM_CENn: D7.C19(IO_L19P_T3_A22_15) D13.87(CEN)
RAM_CLK: D7.C17(IO_L12P_T1_MRCC_AD5P_15) D13.89(CLK)
RAM_D00: D7.A14(IO_L4N_T0_AD9N_15) D13.58(DQA)
RAM_D01: D7.A15(IO_L9N_T1_DQS_AD11N_15) D13.59(DQA)
RAM_D02: D7.A16(IO_L8N_T1_AD3N_15) D13.62(DQA)
RAM_D03: D7.B16(IO_L8P_T1_AD3P_15) D13.63(DQA)
RAM_D04: D7.A18(IO_L10N_T1_AD4N_15) D13.68(DQA)
RAM_D05: D7.A19(IO_L20N_T3_A19_15) D13.69(DQA)
RAM_D06: D7.A20(IO_L22P_T3_A17_15) D13.72(DQA)
RAM_D07: D7.A21(IO_L22N_T3_A16_15) D13.73(DQA)
RAM_D08: D7.B21(IO_L24N_T3_RS0_15) D13.74(DQPA)
RAM_D09: D7.E19(IO_L17N_T2_A25_15) D13.8(DQB)
RAM_D10: D7.B18(IO_L20P_T3_A20_15) D13.9(DQB)
RAM_D11: D7.F18(IO_L17P_T2_A26_15) D13.12(DQB)
RAM_D12: D7.B17(IO_L10P_T1_AD4P_15) D13.13(DQB)
RAM_D13: D7.D17(IO_L14N_T2_SRCC_15) D13.18(DQB)
RAM_D14: D7.D16(IO_L11N_T1_SRCC_AD12N_15) D13.19(DQB)
RAM_D15: D7.E16(IO_L14P_T2_SRCC_15) D13.22(DQB)
RAM_D16: D7.D15(IO_L11P_T1_SRCC_AD12P_15) D13.23(DQB)
RAM_D17: D7.C15(IO_L7N_T1_AD10N_15) D13.24(DQBP)
RAM_LDn: D7.H17(IO_L15P_T2_DQS_15) D13.85(ADV/LD)
RAM_OEn: D7.G17(IO_L15N_T2_DQS_ADV_B_15) D13.86(OE)
RAM_WEn: D7.B20(IO_L24P_T3_RS1_15) D13.88(WE)
ref_in: C130.1 D8.64(REFIN_P)
RXD: R56.1
SCL: D11.6(SCL) R46.1
SDA: D11.5(SDA) R47.1
TCK: D7.K7(TCK_0) X3.6(TCK)
TDI: D7.K6(TDI_0) X3.10(TDI)
TDO: D7.J6(TDO_0) X3.8(TDO)
TMS: D7.L6(TMS_0) X3.4(TMS)
TXD: R58.1
vctrl: C133.1 Q1.1(VCTRL) R30.1 R32.1 R36.2
NetC130_2: C130.2 D9.3(K) R29.2 R33.2
NetC132_1: C132.1 R31.2
NetC134_2: C134.2 D8.52(OUT1_N) R44.1
NetC135_2: C135.2 D8.53(OUT1_P) R44.2
NetC136_2: C136.2 D8.42(OUT2_N) R48.1
NetC137_2: C137.2 D8.43(OUT2_P) R48.2
NetC138_2: C138.2 D8.39(OUT3_N) R50.1
NetC139_2: C139.2 D8.40(OUT3_P) R50.2
NetC140_2: C140.2 R39.1
NetC142_1: C142.1 D8.63(REFIN_N)
NetC143_1: C143.1 D8.14(CLK_N)
NetC167_2: C167.2 D8.10(BYPASS)
NetD8_45: D8.45(OUT7_N) R57.2
NetD8_46: D8.46(OUT7_P) R57.1
NetD8_47: D8.47(OUT6_N) R54.2
NetD8_48: D8.48(OUT6_P) R54.1
NetD8_55: D8.55(OUT0_N) R40.2
NetD8_56: D8.56(OUT0_P) R40.1
NetD8_58: D8.58(RSET) R61.2
NetD8_62: D8.62(CPRSET) R60.2
NetD10_5: D10.5(Y) R38.1
NetH1_3: H1.3(K) R45.1
NetH1_4: H1.4(K) R43.1
NetH2_3: H2.3(K) R52.1
NetH2_4: H2.4(K) R51.1
NetH3_3: H3.3(K) R59.1
NetH3_4: H3.4(K) R55.1
NetQ1_3: Q1.3(OUT) R34.1
NetR29_1: R29.1 XW1.1(RF)
NetR38_2: R38.2 R39.2 R42.2 XW2.1(RF)
NetR43_2: R43.2 T1.3(D)
NetR56_2: R56.2 X4.2(VREF)
NetR58_2: R58.2 X4.3(GND)
NetR108_2: R108.2 X3.2(VREF)
NetR109_2: R109.2 X4.1(GND)

Not connected (* = marked no-connect by the designer): D7 C18(IO_L12N_T1_MRCC_AD5N_15)* E17(IO_L13P_T2_MRCC_15) E18(IO_L13N_T2_MRCC_15) G16(IO_L1N_T0_AD0N_15) H15(IO_25_15) J16(IO_L16P_T2_A28_15) J17(IO_L16N_T2_A27_15); D8 7(REF_SEL) 9(LF) 15(NC) 18(NC) 19(NC) 20(NC) 24(PD) 25(OUT4_P) 26(OUT4_N) 28(OUT5_P) 29(OUT5_N) 34(OUT8_N)* 35(OUT9_P) 36(OUT9_N); D13 1(NC) 2(NC) 3(NC) 6(NC) 7(NC) 10(NC) 14(NC) 16(NC) 25(NC) 28(NC) 29(NC) 30(NC) 38(NC) 39(NC) 42(NC) 43(NC) 51(NC) 52(NC) 53(NC) 56(NC) 57(NC) 66(NC) 75(NC) 78(NC) 79(NC) 84(NC) 95(NC) 96(NC); D14 6(SNS*); X3 12(NC)* 14(NC)*

### Layout directives
net class Power: 3V3_clk_avdd, 6V, AVDD_CLK, DVDD_RAM, GND
differential pair: CLK_ADC_N, CLK_ADC_P, CLK_DAC_N, CLK_DAC_P, CLK_DAC_REF_N, CLK_DAC_REF_P, CLK_FPGA_N, CLK_FPGA_P, clock_rx_n, clock_rx_p, clock_tx_n, clock_tx_p

### Notes on the sheet
- 3kHz BW, 45 deg Phase margin with 5 MHz compare freq and 3mA CP current
- Some clock output's are inverted for routing!
- Bias VCXO to 1.65V when no reference
- 17x
- Подп. и дата
- Инв. № дубл.
- Взам. инв. №
- Инв. № подл.
- Лист
- Изм.
- № докум.
- Подп.
- Дата
- Копировал
- Формат А3
- (in symbol AD9516, part A) CTRL
- (in symbol AD9516, part B) PLL
- (in symbol AD9516, part C) LVPECL
- (in symbol AD9516, part D) LVDS
- (in symbol AD9516, part E) PWR
- (in symbol CY7C1356C, part A) RAM
- (in symbol CY7C1356C, part B) CTRL
- (in symbol CY7C1356C, part C) PWR
- (in symbol XC7K160T-2FBG484C, part C) BANK 15

### Library data of the parts
C129 C130 C133 C141-C143 = CAP: SMD Capacitor; Manufacturer: Murata; Material: X7R; Tolerance: 10%; Type: Ceramic Capacitor; P/N: GRM155R71C104KA88J
C131 = CAP: SMD Capacitor; Manufacturer: Murata; Material: X7R; Tolerance: 10%; Type: Ceramic Capacitor; P/N: GRM155R70J105KA12D
C132 = CAP uF: SMD Capacitor; Manufacturer: Murata; Material: X7R; Tolerance: 10%; Type: Ceramic Capacitor; P/N: GRM32DR60J336ME19L
C134-C139 C144-C155 = CAP: SMD Capacitor; Manufacturer: Murata; Material: X7R; Tolerance: 10%; Voltage: 16V; Type: Ceramic Capacitor; P/N: GRM155R71C104KA88J
C140 = CAP: SMD Capacitor; Manufacturer: Murata; Material: NP0; Tolerance: 10%; Type: Ceramic Capacitor; P/N: GRM1555C1H101JA01D
C156-C161 C164 C166 C168-C175 = CAP: as C38 on sheet FPGAPower
C162 C176 C178 = CAP: as C33 on sheet FPGAPower
C163 C177 C179 = CAP: as C34 on sheet FPGAPower
C165 = CAP uF: as C16 on sheet PowerSupply
C167 = CAP: SMD Capacitor; Manufacturer: Murata; Material: X7R; Tolerance: 10%; Type: Ceramic Capacitor; P/N: GRM155R71C224KA12D
C180 = CAP uF: as C37 on sheet FPGAPower
C181 = CAP: as C73 on sheet FPGAPower
D7 = XC7K160T-2FBG484C: Xilinx 7-Series FPGA; Speed Grade: -2; Manufacturer: Xilinx; Name: XC7K160T-2FBG484C; Series: 7-Series FPGA; Package: 484 Ball FBG
D8 = AD9516: 14-Output Clock Generator; Input Frequency: 0 to 2.4 GHz; Input Sensitivity: 150 mV p-p; Name: AD9516-4; Output Frequency, Maximum: 2950 MHz; Voltage: 2.5 V to 3.3 V; Package: LFSCSP-64; Temperature Range: −40°C to +85°C; Type: 14-Output Clock Generator
D9 = HSMS-281x: RF Schottky Barrier Diodes; Name: HSMS-281C; Package: SOT-323
D10 = ADG3301: Bidirectional Logic Level Translator; Voltage: 1.15 V to 5.5 V; Name: ADG3301; Package: SOT-23-6
D11 = 24LC024: I2C EEPROM; Manufacturer: Microchip; Capacity: 2kbit; Max Clock: 400 kHz; Voltage: 2.5-5.5V; Name: 24LC024; Package: SOIC-8; Type: I2C EEPROM
D12 = N25Q128A: SPI Flash; Manufacturer: Micron Technology; Device Density: 128 Mbit; Name: N25Q128A13ESE40; Operating Frequency: 50 MHz; Voltage: 2.7-3.6V; Package: SOIC; Temperature Range: 0°C to +70°C; Type: SPI Flash
D13 = CY7C1356C: Pipelined SRAM with NoBL; Name: CY7C1356C-250AXC; Type: 9-Mbit (512 K × 18); Voltage: 3.3 V; Package: 100-pin TQFP (14 × 20 × 1.4 mm)
D14 = LP38692: Linear Regulator; P/N: LP38692MP-3.3/NOPB
H1-H3 = LED_PACK: LED Pack For Front Panel; Manufacturer: Kingbright; Current: 25mA; P/N: WP934EB/2GD; Color: Green; Package: Throu-Hole; Type: 2-level PCB-mount LED-indicator
L16 = Inductor LF: Inductor Power Lines; Manufacturer: Murata; Name: LQM32PN1R0MG0; Current: 2500mA; Tolerance: 5%; Frequency: 100MHz; Temperature Range: -25ºC to 85ºC; Series: LQM; P/N: LQM32PN1R0MG0
Q1 = CVHD-950: Crystal Oscillator; Input Current: 15mA Typical; Name: CVHD-950-100.000; Output: Unsymmetry; Output Current: ±24mA Max; Voltage: 3.3V ±0.3V; Package: CVHD-950; Temperature Range: 0°C to +70°C
R29 R33 = RES: SMD Resistor; Name: Chip SMD Resistor; Power: 0.062 Wt; P/N: ERJ-2RKF24R9X; Temperature Range: -55…155°C
R30 R36 = RES: SMD Resistor; Name: Chip SMD Resistor; Power: 0.062 Wt; Temperature Range: -55…155°C
R31 = RES: SMD Resistor; Name: Chip SMD Resistor; Power: 0.062 Wt; Tolerance: 5%; P/N: ERJ-2GEJ391X; Temperature Range: -55…155°C
R32 = RES: SMD Resistor; Name: Chip SMD Resistor; Power: 0.062 Wt; Tolerance: 5%; P/N: ERJ-2GEJ123X; Temperature Range: -55…155°C
R34 = RES 2x0402: Chip Resistor Array; Manufacturer: Panasonic; Name: EXB24V; Number of Resistors: 2; Tolerance: 5%; P/N: EXB-24V270JX; Type: 0402 Array Convex Terminal; Number of Terminals: 4; Series: EXB
R35 R37 R46 R47 R49 R53 = RES: SMD Resistor; Name: Chip SMD Resistor; Power: 0.062 Wt; Tolerance: 5%; P/N: ERJ-2GEJ222X; Temperature Range: -55…155°C
R38 = RES: SMD Resistor; Name: Chip SMD Resistor; Power: 0.062 Wt; Tolerance: 5%; P/N: ERJ-2GEJ102X; Temperature Range: -55…155°C
R39 = RES: SMD Resistor; Name: Chip SMD Resistor; Power: 0.062 Wt; P/N: ERJ-2RKF49R9X; Temperature Range: -55…155°C
R40 = RES 2x0402: Chip Resistor Array; Manufacturer: Panasonic; Name: EXB24V; Number of Resistors: 2; Tolerance: 5%; P/N: EXB-24V510JX; Type: 0402 Array Convex Terminal; Number of Terminals: 4; Series: EXB
R41 = RES 2x0402: Chip Resistor Array; Manufacturer: Panasonic; Name: EXB24V; Number of Resistors: 2; Tolerance: 5%; P/N: EXB-24V101JX; Type: 0402 Array Convex Terminal; Number of Terminals: 4; Series: EXB
R42 = RES: SMD Resistor; Name: Chip SMD Resistor; Power: 0.062 Wt; Tolerance: 5%; P/N: ERJ-2GEJ103X; Temperature Range: -55…155°C
R43 R45 R51 R52 R55 R59 = RES: SMD Resistor; Name: Chip SMD Resistor; Power: 0.062 Wt; Tolerance: 5%; P/N: ERJ-2GEJ680X; Temperature Range: -55…155°C
R44 R48 R50 = RES 2x0402: Chip Resistor Array; Manufacturer: Panasonic; Name: EXB24V; Number of Resistors: 2; Tolerance: 5%; P/N: EXB-24V201JX; Type: 0402 Array Convex Terminal; Number of Terminals: 4; Series: EXB
R54 R57 = RES 2x0402: Chip Resistor Array; Manufacturer: Panasonic; Name: EXB24V; Number of Resistors: 2; P/N: EXB-24VR000X; Type: 0402 Array Convex Terminal; Number of Terminals: 4; Series: EXB
R56 R58 R108 R109 = RES: SMD Resistor; Name: Chip SMD Resistor; Power: 0.062 Wt; Tolerance: 5%; P/N: ERJ-2GEJ331X; Temperature Range: -55…155°C
R60 = RES: SMD Resistor; Name: Chip SMD Resistor; Power: 0.062 Wt; P/N: ERJ-2RKF5101X; Temperature Range: -55…155°C
R61 = RES: SMD Resistor; Name: Chip SMD Resistor; Power: 0.062 Wt; P/N: ERJ-2RKF4121X; Temperature Range: -55…155°C
SB1 = Button: Tactile Switch (SMT); Manufacturer: Omron; Current: 50mA; Operating  force: 2.55 N; Plunger  color: Black; Voltage: 24V; Name: B3FS-1000; Package: 6x6 SMT; Series: B3FS-1000; Type: Tactile Switch (SMT)
T1 = 2N7002: N-Channel MOSFET 2N7002; Channel Resistance: 5Ohm; Current: 300mA; Power Dissipation: 0.83W; Voltage: 60V; Name: 2N7002; Type: SOT-23; Package: SOT-23
X3 = HDR Debug_14-pin: 14-pin 2.54mm pitch PCB Header; Name: JTAG Header 7x2; Type: Two Row Male Header 100mil Step
X4 = HDR 4-way: 4-way Angle PCB Header; Pitch: 2.54mm; Name: Header; Package: Through Hole; Type: Right Angle
XW1 XW2 = SMA RF Connector: SMA Male Right-Angle PCM Connector; Manufacturer: Molex; Name: SMA Right Angle PCB Mount RF Connector; P/N: 732512201; Impedance: 50Ohm; Type: SMA Jack, Right Angle; Series: 73251